# Altium schematic sheet Allwinner_A13_SCH.SchDoc
size A1; PageSetup: Record=PageOptions|CenterHorizontal=True|CenterVertical=True|PrintScale=1.00|XCorrection=1.00|YCorrection=1.00|PrintKind=0|BorderSize=5000000|LeftOffset=0|BottomOffset=0|Orientation=2|PaperLength=1000|PaperWidth=1000|Scale=100|PaperSource=4|PrintQuality=-3|MediaType=1|DitherType=10|PrintScaleMode=1|PaperKind=A4|PaperIndex=9
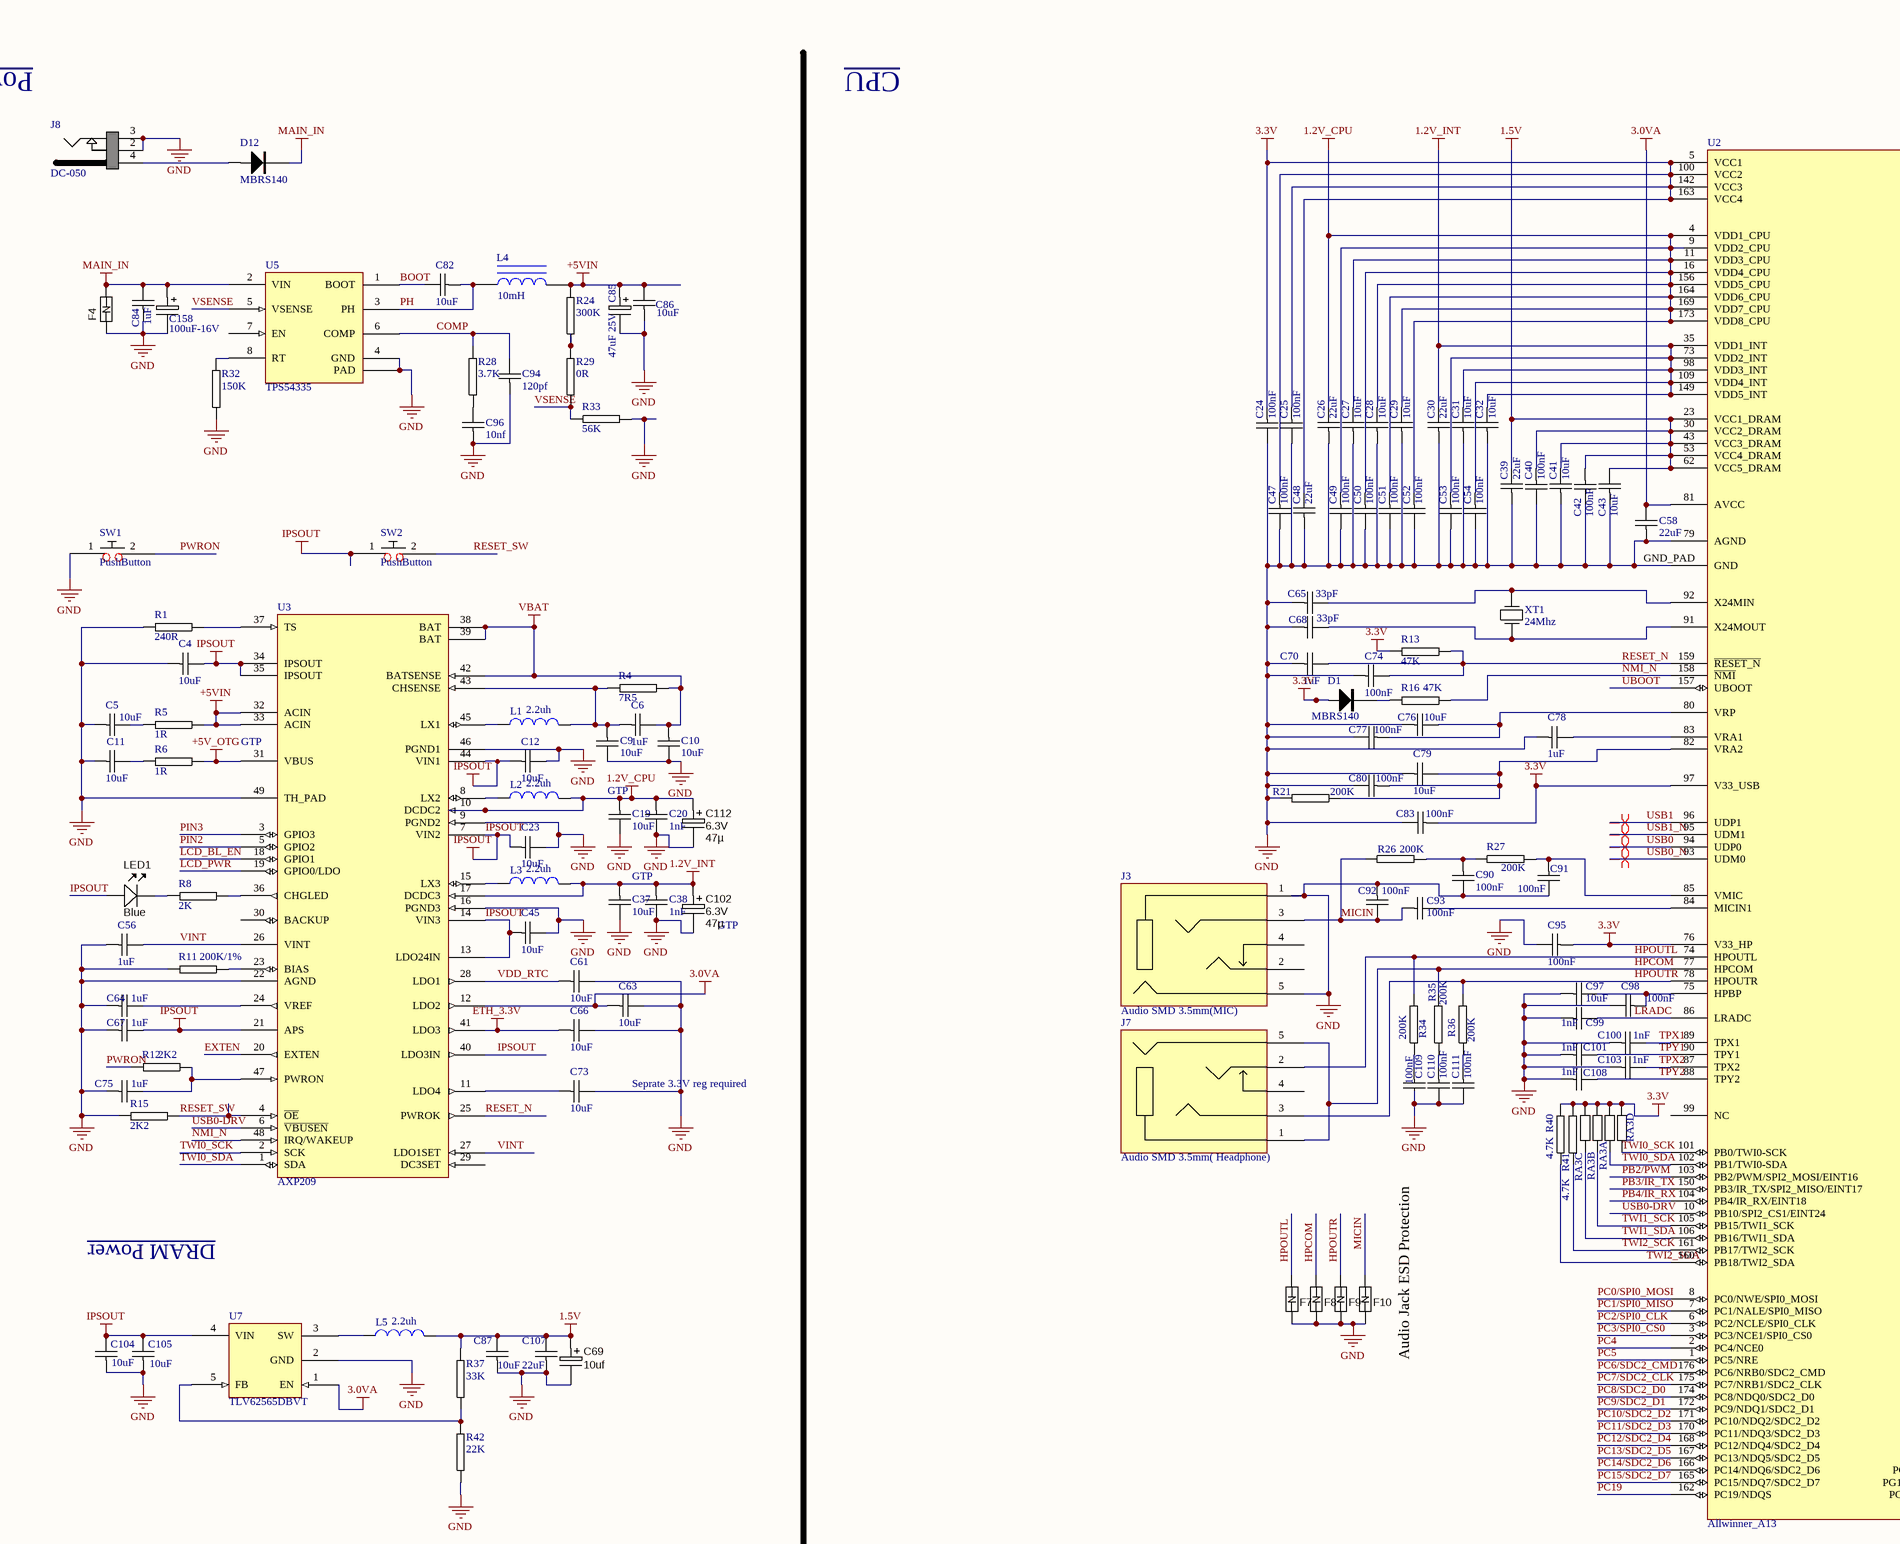
[diagram p0: Allwinner_A13_SCH.SchDoc, top left]
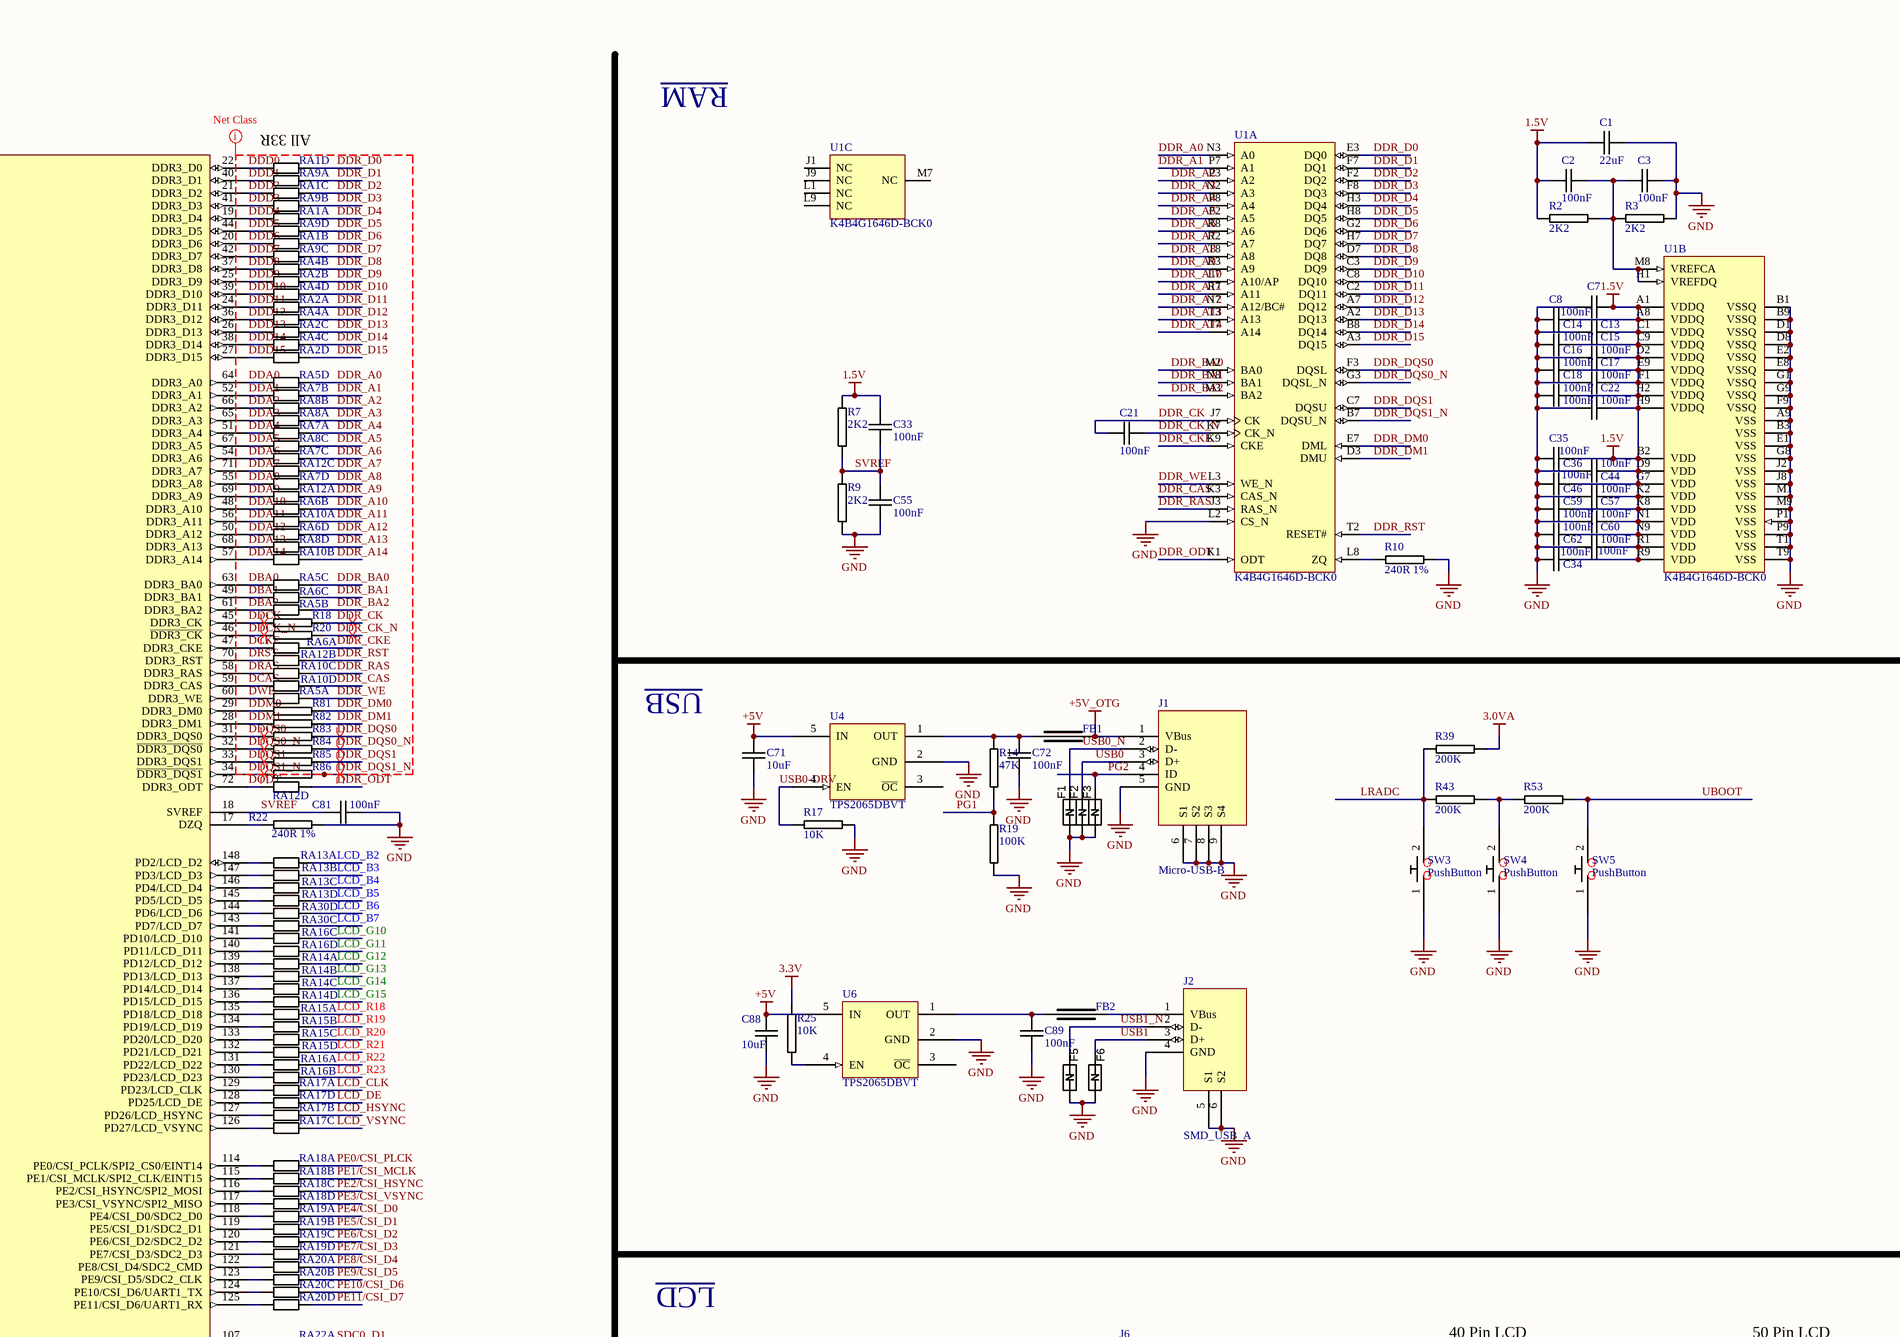
[diagram p1: Allwinner_A13_SCH.SchDoc, top right]
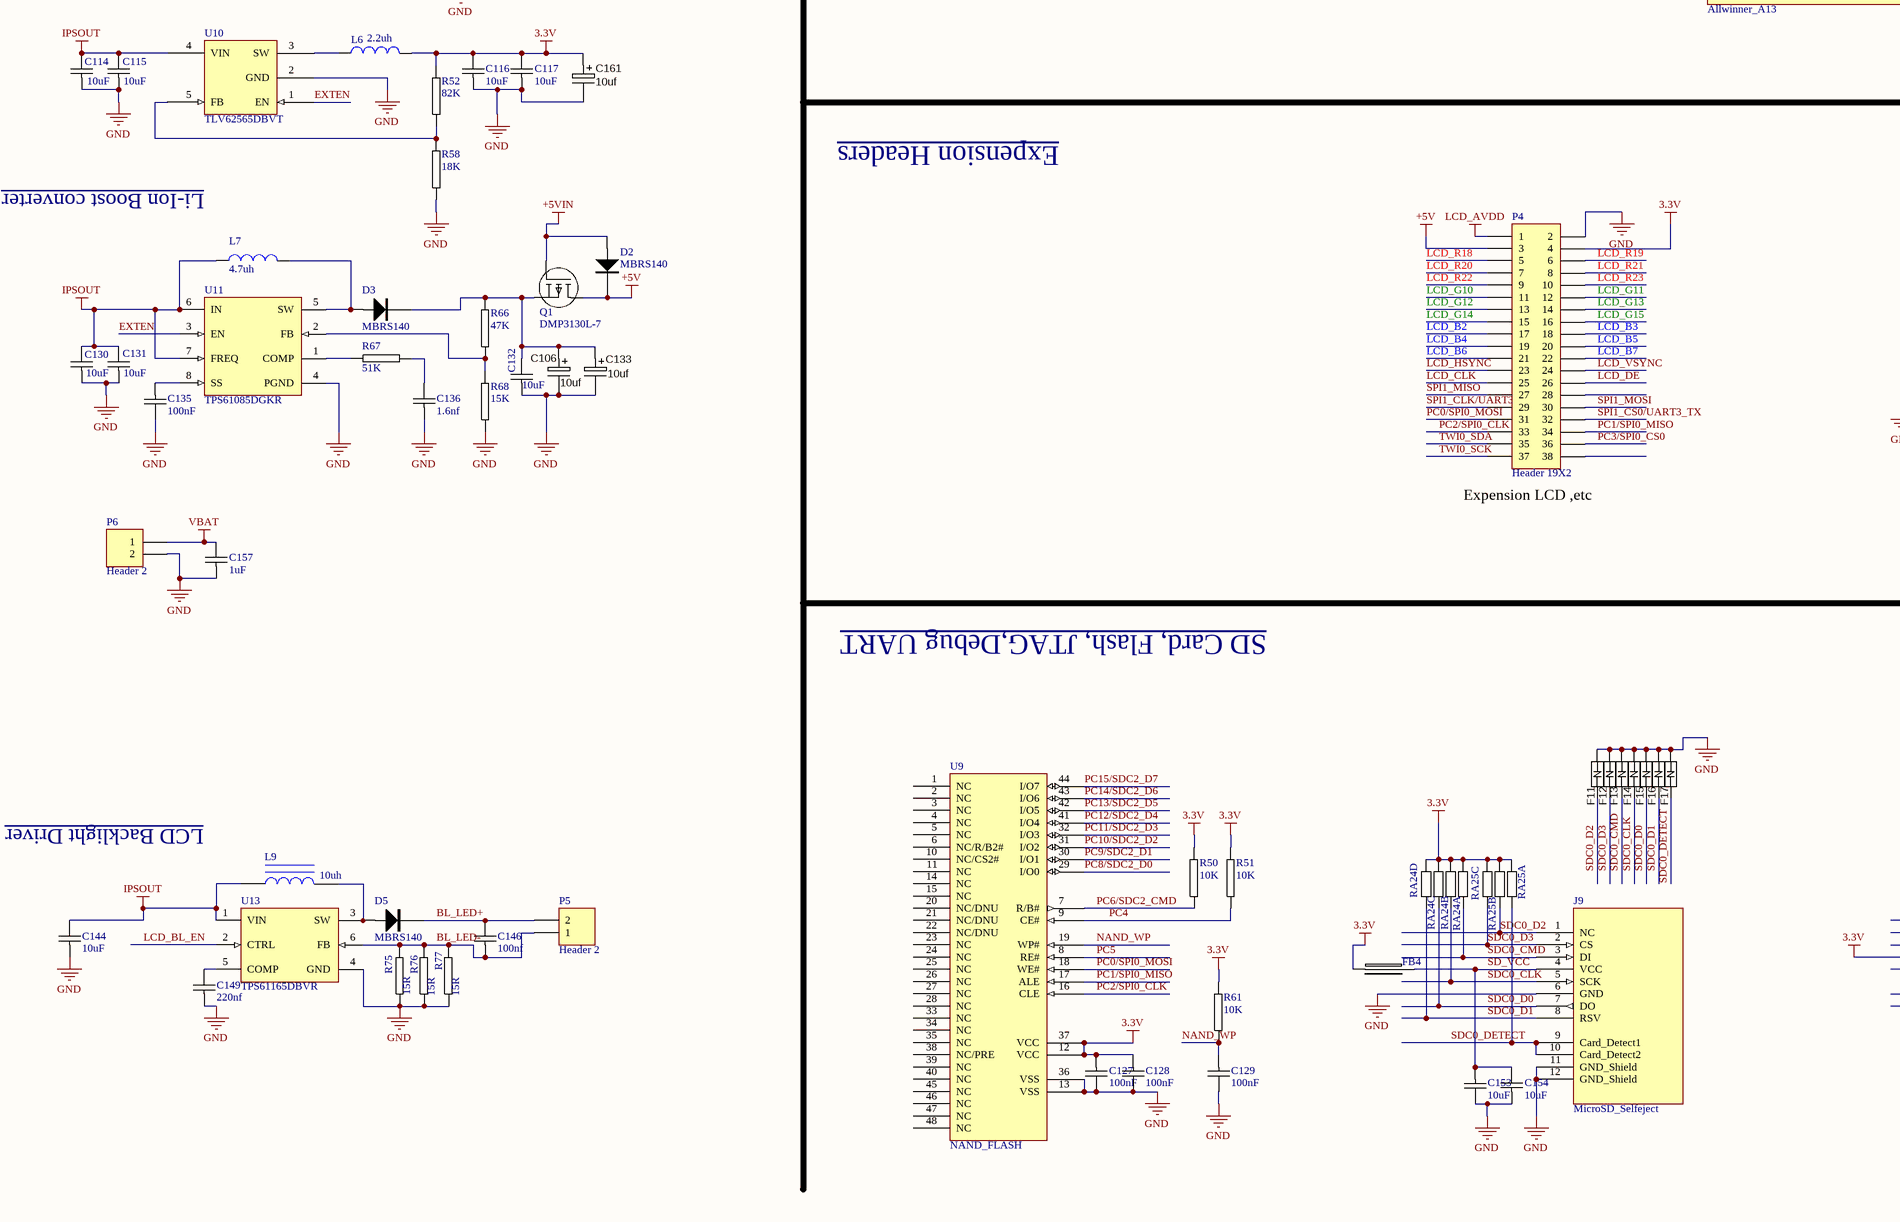
[diagram p2: Allwinner_A13_SCH.SchDoc, bottom left]
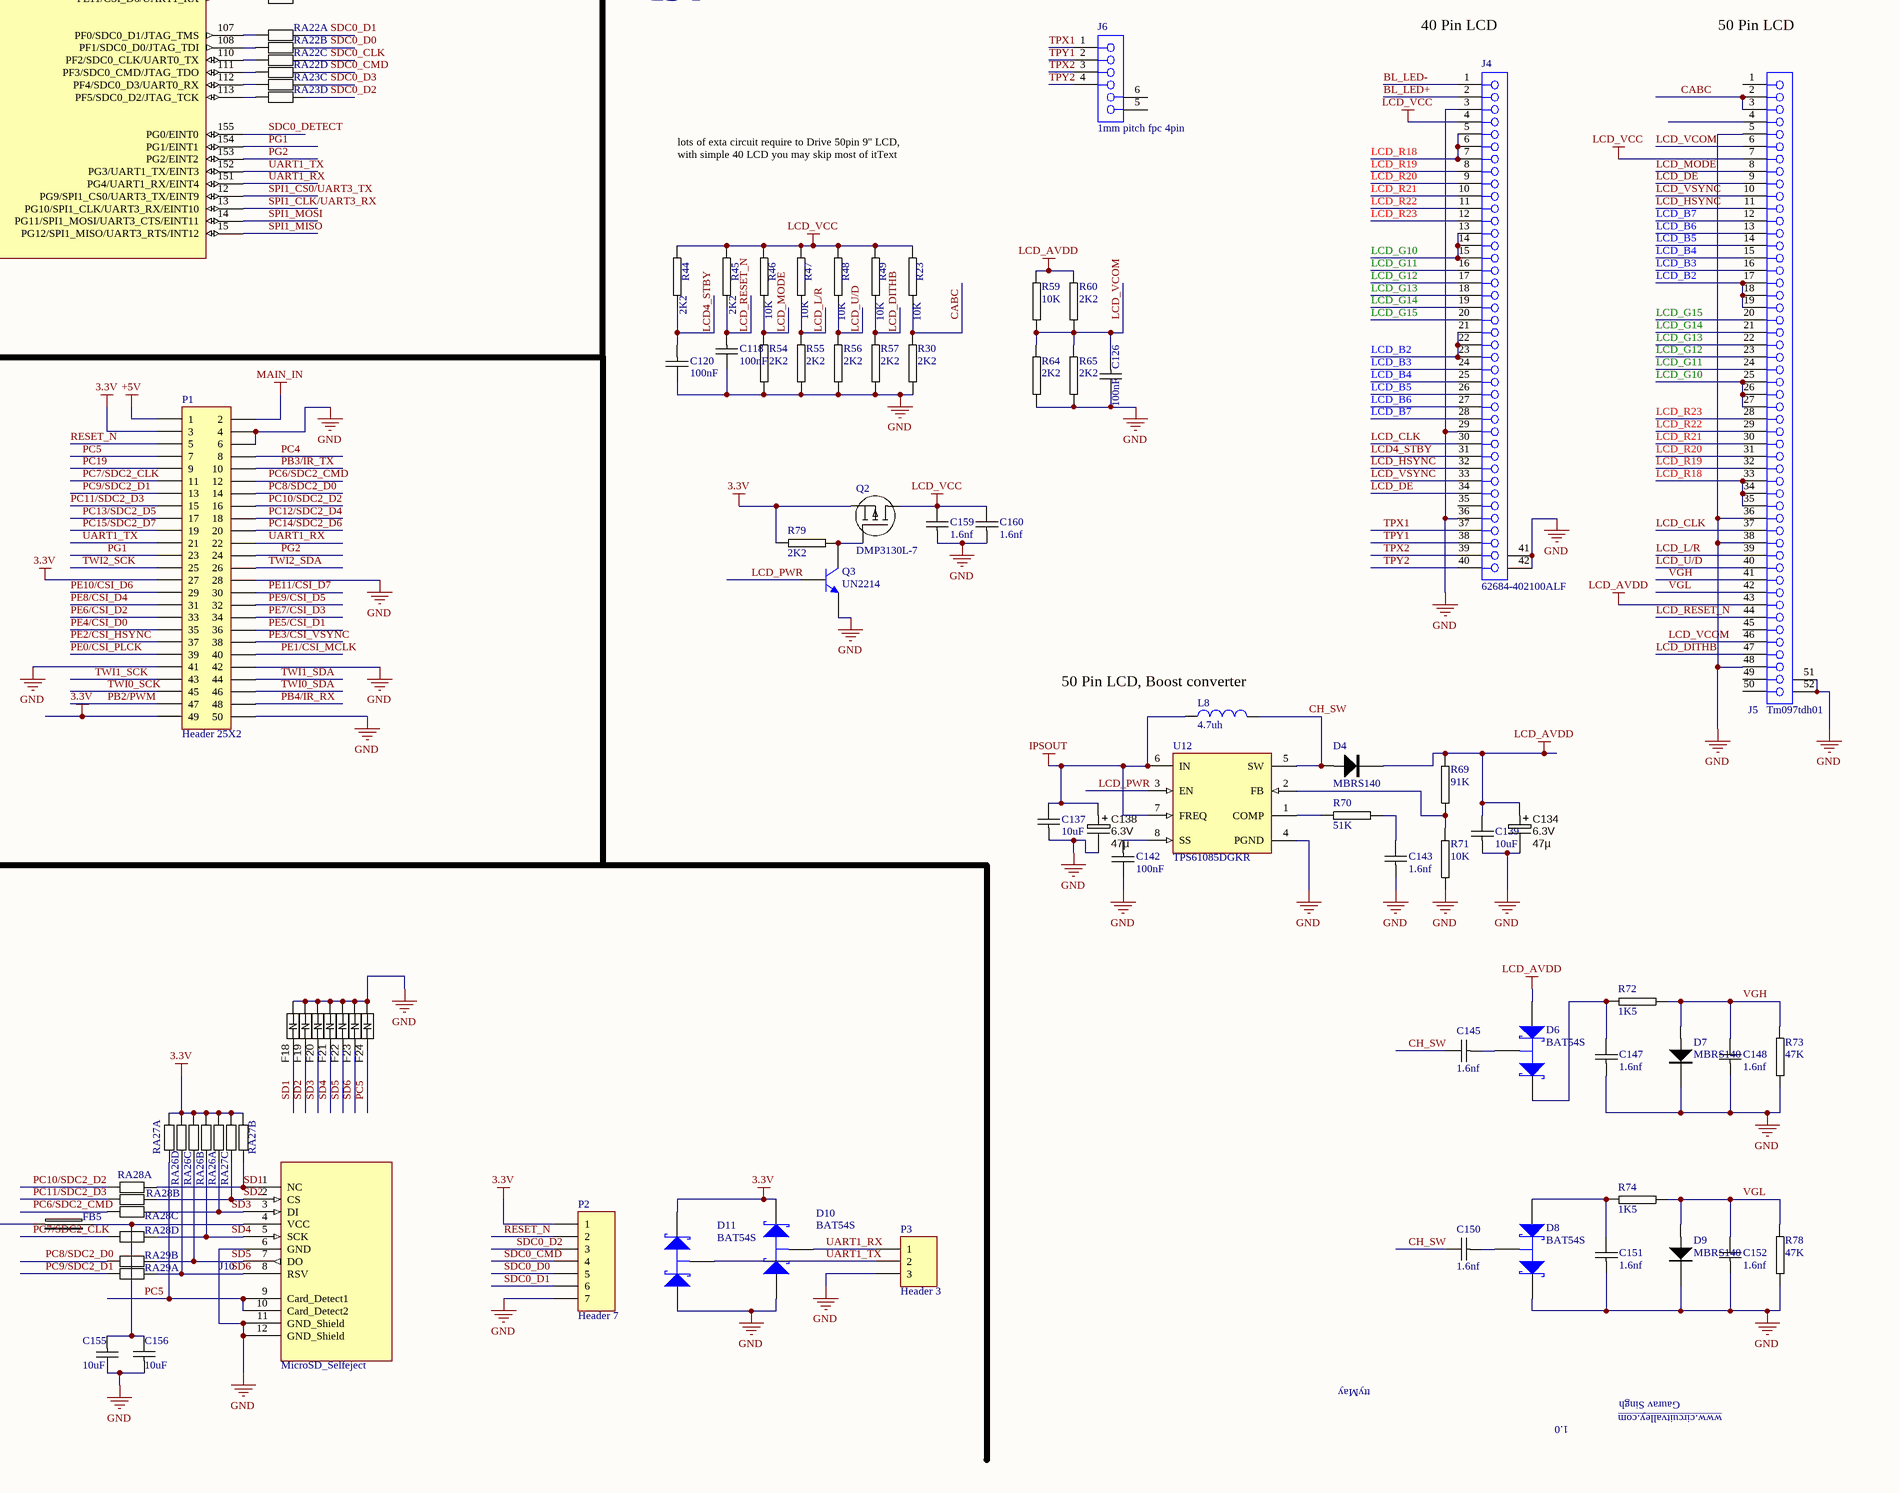
[diagram p3: Allwinner_A13_SCH.SchDoc, bottom right]

## Parts
C1  22uF  [0603C-GENERIC]
C2  100nF  [0603C-GENERIC]
C3  100nF  [0603C-GENERIC]
C4  10uF  [0603C-GENERIC]
C5  10uF  [0603C-GENERIC]
C6  1uF  [0603C-GENERIC]
C7  100nF  [0603C-GENERIC]
C8  100nF  [0603C-GENERIC]
C9  10uF  [0603C-GENERIC]
C10  10uF  [0603C-GENERIC]
C11  10uF  [0603C-GENERIC]
C12  10uF  [0603C-GENERIC]
C13  100nF  [0603C-GENERIC]
C14  100nF  [0603C-GENERIC]
C15  100nF  [0603C-GENERIC]
C16  100nF  [0603C-GENERIC]
C17  100nF  [0603C-GENERIC]
C18  100nF  [0603C-GENERIC]
C19  10uF  [0603C-GENERIC]
C20  1nF  [0603C-GENERIC]
C21  100nF  [0603C-GENERIC]
C22  100nF  [0603C-GENERIC]
C23  10uF  [0603C-GENERIC]
C24  100nF  [0603C-GENERIC]
C25  100nF  [0603C-GENERIC]
C26  22uF  [0603C-GENERIC]
C27  10uF  [0603C-GENERIC]
C28  10uF  [0603C-GENERIC]
C29  10uF  [0603C-GENERIC]
C30  22uF  [0603C-GENERIC]
C31  10uF  [0603C-GENERIC]
C32  10uF  [0603C-GENERIC]
C33  100nF  [0603C-GENERIC]
C34  100nF  [0603C-GENERIC]
C35  100nF  [0603C-GENERIC]
C36  100nF  [0603C-GENERIC]
C37  10uF  [0603C-GENERIC]
C38  1nF  [0603C-GENERIC]
C39  22uF  [0603C-GENERIC]
C40  100nF  [0603C-GENERIC]
C41  10uF  [0603C-GENERIC]
C42  100nF  [0603C-GENERIC]
C43  10uF  [0603C-GENERIC]
C44  100nF  [0603C-GENERIC]
C45  10uF  [0603C-GENERIC]
C46  100nF  [0603C-GENERIC]
C47  100nF  [0603C-GENERIC]
C48  22uF  [0603C-GENERIC]
C49  100nF  [0603C-GENERIC]
C50  100nF  [0603C-GENERIC]
C51  100nF  [0603C-GENERIC]
C52  100nF  [0603C-GENERIC]
C53  100nF  [0603C-GENERIC]
C54  100nF  [0603C-GENERIC]
C55  100nF  [0603C-GENERIC]
C56  1uF  [0603C-GENERIC]
C57  100nF  [0603C-GENERIC]
C58  22uF  [0603C-GENERIC]
C59  100nF  [0603C-GENERIC]
C60  100nF  [0603C-GENERIC]
C61  10uF  [0603C-GENERIC]
C62  100nF  [0603C-GENERIC]
C63  10uF  [0603C-GENERIC]
C64  1uF  [0603C-GENERIC]
C65  33pF  [0603C-GENERIC]
C66  10uF  [0603C-GENERIC]
C67  1uF  [0603C-GENERIC]
C68  33pF  [0603C-GENERIC]
C69  10uf  [CAPMP3528X210N]
C70  1uF  [0603C-GENERIC]
C71  10uF  [0603C-GENERIC]
C72  100nF  [0603C-GENERIC]
C73  10uF  [0603C-GENERIC]
C74  100nF  [0603C-GENERIC]
C75  1uF  [0603C-GENERIC]
C76  10uF  [0603C-GENERIC]
C77  100nF  [0603C-GENERIC]
C78  1uF  [0603C-GENERIC]
C79  10uF  [0603C-GENERIC]
C80  100nF  [0603C-GENERIC]
C81  100nF  [0603C-GENERIC]
C82  10uF  [0603C-GENERIC]
C83  100nF  [0603C-GENERIC]
C84  1uF  [0603C-GENERIC]
C85  47uF 25V  [PANACAP-E-GENERIC]
C86  10uF  [0603C-GENERIC]
C87  10uF  [0603C-GENERIC]
C88  10uF  [0603C-GENERIC]
C89  100nF  [0603C-GENERIC]
C90  100nF  [0603C-GENERIC]
C91  100nF  [0603C-GENERIC]
C92  100nF  [0603C-GENERIC]
C93  100nF  [0603C-GENERIC]
C94  120pf  [0603C-GENERIC]
C95  100nF  [0603C-GENERIC]
C96  10nf  [0603C-GENERIC]
C97  10uF  [0603C-GENERIC]
C98  100nF  [0603C-GENERIC]
C99  1nF  [0603C-GENERIC]
C100  1nF  [0603C-GENERIC]
C101  1nF  [0603C-GENERIC]
C102  Ratings: 6.3V  [CAPMP3528X210N]  (hidden comment: 47µ)
C103  1nF  [0603C-GENERIC]
C104  10uF  [0603C-GENERIC]
C105  10uF  [0603C-GENERIC]
C106  10uf  [CAPMP3528X210N]
C107  22uF  [0603C-GENERIC]
C108  1nF  [0603C-GENERIC]
C109  100nF  [0603C-GENERIC]
C110  100nF  [0603C-GENERIC]
C111  100nF  [0603C-GENERIC]
C112  Ratings: 6.3V  [CAPMP3528X210N]  (hidden comment: 47µ)
C114  10uF  [0603C-GENERIC]
C115  10uF  [0603C-GENERIC]
C116  10uF  [0603C-GENERIC]
C117  10uF  [0603C-GENERIC]
C118  100nF  [0603C-GENERIC]
C120  100nF  [0603C-GENERIC]
C126  100nF  [0603C-GENERIC]
C127  100nF  [0603C-GENERIC]
C128  100nF  [0603C-GENERIC]
C129  100nF  [0603C-GENERIC]
C130  10uF  [0603C-GENERIC]
C131  10uF  [0603C-GENERIC]
C132  10uF  [0603C-GENERIC]
C133  10uf  [CAPMP6032X280N]
C134  Ratings: 6.3V  [CAPMP3528X210N]  (hidden comment: 47µ)
C135  100nF  [0603C-GENERIC]
C136  1.6nf  [0603C-GENERIC]
C137  10uF  [0603C-GENERIC]
C138  Ratings: 6.3V  [CAPMP3528X210N]  (hidden comment: 47µ)
C139  10uF  [0603C-GENERIC]
C142  100nF  [0603C-GENERIC]
C143  1.6nf  [0603C-GENERIC]
C144  10uF  [0603C-GENERIC]
C145  1.6nf  [0603C-GENERIC]
C146  100nf  [0603C-GENERIC]
C147  1.6nf  [0603C-GENERIC]
C148  1.6nf  [0603C-GENERIC]
C149  220nf  [0603C-GENERIC]
C150  1.6nf  [0603C-GENERIC]
C151  1.6nf  [0603C-GENERIC]
C152  1.6nf  [0603C-GENERIC]
C153  10uF  [0603C-GENERIC]
C154  10uF  [0603C-GENERIC]
C155  10uF  [0603C-GENERIC]
C156  10uF  [0603C-GENERIC]
C157  1uF  [0603C-GENERIC]
C158  100uF-16V  [PANACAP-D-GENERIC]
C159  1.6nf  [0603C-GENERIC]
C160  1.6nf  [0603C-GENERIC]
C161  10uf  [CAPMP3528X210N]
D1  MBRS140  [DIODE-SMA]
D2  MBRS140  [DIODE-SMA]
D3  MBRS140  [DIODE-SMA]
D4  MBRS140  [DIODE-SMA]
D5  MBRS140  [DIODE-SMA]
D6  BAT54S  [SOT23_N]
D7  MBRS140  [DIODE-SMA]
D8  BAT54S  [SOT23_N]
D9  MBRS140  [DIODE-SMA]
D10  BAT54S  [SOT23_N]
D11  BAT54S  [SOT23_N]
D12  MBRS140  [DIODE-SMA]
F1  ESD suppressor  [0603ESDA]  (value not drawn)
F2  ESD suppressor  [0603ESDA]  (value not drawn)
F3  ESD suppressor  [0603ESDA]  (value not drawn)
F4  ESD suppressor  [0603ESDA]  (value not drawn)
F5  ESD suppressor  [0603ESDA]  (value not drawn)
F6  ESD suppressor  [0603ESDA]  (value not drawn)
F7  ESD suppressor  [0603ESDA]  (value not drawn)
F8  ESD suppressor  [0603ESDA]  (value not drawn)
F9  ESD suppressor  [0603ESDA]  (value not drawn)
F10  ESD suppressor  [0603ESDA]  (value not drawn)
F11  ESD suppressor  [0603ESDA]  (value not drawn)
F12  ESD suppressor  [0603ESDA]  (value not drawn)
F13  ESD suppressor  [0603ESDA]  (value not drawn)
F14  ESD suppressor  [0603ESDA]  (value not drawn)
F15  ESD suppressor  [0603ESDA]  (value not drawn)
F16  ESD suppressor  [0603ESDA]  (value not drawn)
F17  ESD suppressor  [0603ESDA]  (value not drawn)
F18  ESD suppressor  [0603ESDA]  (value not drawn)
F19  ESD suppressor  [0603ESDA]  (value not drawn)
F20  ESD suppressor  [0603ESDA]  (value not drawn)
F21  ESD suppressor  [0603ESDA]  (value not drawn)
F22  ESD suppressor  [0603ESDA]  (value not drawn)
F23  ESD suppressor  [0603ESDA]  (value not drawn)
F24  ESD suppressor  [0603ESDA]  (value not drawn)
FB1  (no value)  [0805FB-GENERIC]
FB2  (no value)  [0805FB-GENERIC]
FB4  (no value)  [0805FB-GENERIC]
FB5  (no value)  [0805FB-GENERIC]
J1  Micro-USB-B  [USB-MICRO-HW-MC-5F]
J2  SMD_USB_A  [USBA_HW-UAF-12]
J3  Audio SMD 3.5mm(MIC)  [SMDAudio3.5mm]
J4  62684-402100ALF  [62684-402100ALF]
J5  Tm097tdh01  [FH12A-50S-0.5SH]
J6  1mm pitch fpc 4pin  [52793-0470]
J7  Audio SMD 3.5mm( Headphone)  [SMDAudio3.5mm]
J8  DC-050  [DC-050]
J9  MicroSD_Selfeject  [MicroSD_Selfeject]
J10  MicroSD_Selfeject  [MicroSD_Selfeject]
L1  2.2uh  [TAIYO_NRS4018T2R2MDGJ]
L2  2.2uh  [TAIYO_NRS4018T2R2MDGJ]
L3  2.2uh  [TAIYO_NRS4018T2R2MDGJ]
L4  value 10mH  [Inductor-Multicomp-MCSDC060]
L5  2.2uh  [TAIYO_NRS4018T2R2MDGJ]
L6  2.2uh  [TAIYO_NRS4018T2R2MDGJ]
L7  4.7uh  [TAIYO_NR6028T4R7M]
L8  4.7uh  [TAIYO_NR6028T4R7M]
L9  value 10uh  [Inductor-Multicomp-MCSDC060]
LED1  Blue  [LED-0805-K]
P1  Header 25X2  [HDR2X25]
P2  Header 7  [HDR1X7]
P3  Header 3  [HDR1X3]
P4  Header 19X2  [HDR2X19]
P5  Header 2  [HDR1X2]
P6  Header 2  [HDR1X2]
Q1  DMP3130L-7  [SOT23-GDS]
Q2  DMP3130L-7  [SOT23-GDS]
Q3  UN2214  [SOT23_N]
R1  240R  [0603R-GENERIC]
R2  2K2  [0603R-10K]
R3  2K2  [0603R-10K]
R4  7R5  [2512R-GENERIC]
R5  1R  [0603R-GENERIC]
R6  1R  [0603R-GENERIC]
R7  2K2  [0603R-10K]
R8  2K  [0603R-220K]
R9  2K2  [0603R-10K]
R10  240R 1%  [0603R-10K]
R11  200K/1%  [0603R-220K]
R12  2K2  [0603R-2K2]
R13  47K  [0603R-47K]
R14  47K  [0603R-10K]
R15  2K2  [0603R-2K2]
R16  47K  [0603R-47K]
R17  10K  [0603R-10K]
R18  (no value)  [0402R-GENERIC]
R19  100K  [0603R-10K]
R20  (no value)  [0402R-GENERIC]
R21  200K  [0603R-220K]
R22  240R 1%  [0603R-10K]
R23  10K  [0603R-10K]
R24  300K  [0603R-2K2]
R25  10K  [0603R-10K]
R26  200K  [0603R-220K]
R27  200K  [0603R-220K]
R28  3.7K  [0603R-2K2]
R29  0R  [0603R-2K2]
R30  2K2  [0603R-2K2]
R32  150K  [0603R-2K2]
R33  56K  [0603R-2K2]
R34  200K  [0603R-220K]
R35  200K  [0603R-220K]
R36  200K  [0603R-220K]
R37  33K  [0603R-2K2]
R39  200K  [0603R-220K]
R40  4.7K  [0603R-220K]
R41  4.7K  [0603R-220K]
R42  22K  [0603R-2K2]
R43  200K  [0603R-220K]
R44  2K2  [0603R-2K2]
R45  2K2  [0603R-2K2]
R46  10K  [0603R-10K]
R47  10K  [0603R-10K]
R48  10K  [0603R-10K]
R49  10K  [0603R-10K]
R50  10K  [0603R-220K]
R51  10K  [0603R-220K]
R52  82K  [0603R-2K2]
R53  200K  [0603R-220K]
R54  2K2  [0603R-2K2]
R55  2K2  [0603R-2K2]
R56  2K2  [0603R-2K2]
R57  2K2  [0603R-2K2]
R58  18K  [0603R-2K2]
R59  10K  [0603R-10K]
R60  2K2  [0603R-2K2]
R61  10K  [0603R-220K]
R64  2K2  [0603R-2K2]
R65  2K2  [0603R-2K2]
R66  47K  [0603R-2K2]
R67  51K  [0603R-2K2]
R68  15K  [0603R-2K2]
R69  91K  [0603R-2K2]
R70  51K  [0603R-2K2]
R71  10K  [0603R-2K2]
R72  1K5  [0603R-2K2]
R73  47K  [0603R-2K2]
R74  1K5  [0603R-2K2]
R75  15R  [0603R-2K2]
R76  15R  [0603R-2K2]
R77  15R  [0603R-2K2]
R78  47K  [0603R-2K2]
R79  2K2  [0603R-2K2]
R81  (no value)  [0402R-GENERIC]
R82  (no value)  [0402R-GENERIC]
R83  (no value)  [0402R-GENERIC]
R84  (no value)  [0402R-GENERIC]
R85  (no value)  [0402R-GENERIC]
R86  (no value)  [0402R-GENERIC]
RA1  Thick Film  [EXV28V]  (value not drawn)  (parts A,B,C,D of 4)
RA2  Thick Film  [EXV28V]  (value not drawn)  (parts A,B,C,D of 4)
RA3  Thick Film  [EXV28V]  (value not drawn)  (parts A,B,C,D of 4)
RA4  Thick Film  [EXV28V]  (value not drawn)  (parts A,B,C,D of 4)
RA5  Thick Film  [EXV28V]  (value not drawn)  (parts A,B,C,D of 4)
RA6  Thick Film  [EXV28V]  (value not drawn)  (parts A,B,C,D of 4)
RA7  Thick Film  [EXV28V]  (value not drawn)  (parts A,B,C,D of 4)
RA8  Thick Film  [EXV28V]  (value not drawn)  (parts A,B,C,D of 4)
RA9  Thick Film  [EXV28V]  (value not drawn)  (parts A,B,C,D of 4)
RA10  Thick Film  [EXV28V]  (value not drawn)  (parts A,B,C,D of 4)
RA12  Thick Film  [EXV28V]  (value not drawn)  (parts A,B,C,D of 4)
RA13  Thick Film  [EXV28V]  (value not drawn)  (parts A,B,C,D of 4)
RA14  Thick Film  [EXV28V]  (value not drawn)  (parts A,B,C,D of 4)
RA15  Thick Film  [EXV28V]  (value not drawn)  (parts A,B,C,D of 4)
RA16  Thick Film  [EXV28V]  (value not drawn)  (parts A,B,C,D of 4)
RA17  Thick Film  [EXV28V]  (value not drawn)  (parts A,B,C,D of 4)
RA18  Thick Film  [EXV28V]  (value not drawn)  (parts A,B,C,D of 4)
RA19  Thick Film  [EXV28V]  (value not drawn)  (parts A,B,C,D of 4)
RA20  Thick Film  [EXV28V]  (value not drawn)  (parts A,B,C,D of 4)
RA22  Thick Film  [EXV28V]  (value not drawn)  (parts A,B,C,D of 4)
RA23  Thick Film  [EXV28V]  (value not drawn)  (parts C,D of 4)
RA24  Thick Film  [EXV28V]  (value not drawn)  (parts A,B,C,D of 4)
RA25  Thick Film  [EXV28V]  (value not drawn)  (parts A,B,C of 4)
RA26  Thick Film  [EXV28V]  (value not drawn)  (parts A,B,C,D of 4)
RA27  Thick Film  [EXV28V]  (value not drawn)  (parts A,B,C of 4)
RA28  Thick Film  [EXV28V]  (value not drawn)  (parts A,B,C,D of 4)
RA29  Thick Film  [EXV28V]  (value not drawn)  (parts A,B of 4)
RA30  Thick Film  [EXV28V]  (value not drawn)  (parts C,D of 4)
SW1  PushButton  [PushButtonGrid5.08x3.81]
SW2  PushButton  [PushButtonGrid5.08x3.81]
SW3  PushButton  [PushButtonGrid5.08x3.81]
SW4  PushButton  [PushButtonGrid5.08x3.81]
SW5  PushButton  [PushButtonGrid5.08x3.81]
U1  K4B4G1646D-BCK0  [MICT-JT-96]  (parts A,B,C of 3)
U2  Allwinner_A13  [LQFP176L]
U3  AXP209  [QFN48]
U4  TPS2065DBVT  [TSOT23-5]
U5  TPS54335  [D008_L_PowerPad]
U6  TPS2065DBVT  [TSOT23-5]
U7  TLV62565DBVT  [TSOT23-5]
U9  NAND_FLASH  [TSOP-48]
U10  TLV62565DBVT  [TSOT23-5]
U11  TPS61085DGKR  [TI-DGK8_N]
U12  TPS61085DGKR  [TI-DGK8_N]
U13  TPS61165DBVR  [TI-DBV6_N]
XT1  24Mhz  [Ceramic_crystal_5x3.2]

## Nets
1.2V_CPU: C19.1 C20.1 C26.2 C27.2 C28.2 C29.2 C49.1 C50.1 C51.1 C52.1 C112.1 L2.2 U2.4(VDD1_CPU) U2.9(VDD2_CPU) U2.11(VDD3_CPU) U2.16(VDD4_CPU) U2.156(VDD5_CPU) U2.164(VDD6_CPU) U2.169(VDD7_CPU) U2.173(VDD8_CPU) U3.10(DCDC2)
1.2V_INT: C30.2 C31.2 C32.2 C37.1 C38.1 C53.1 C54.1 C102.1 L3.2 U2.35(VDD1_INT) U2.73(VDD2_INT) U2.98(VDD3_INT) U2.109(VDD4_INT) U2.149(VDD5_INT) U3.17(DCDC3)
1.5V: C1.2 C2.2 C7.1 C8.1 C13.1 C14.1 C15.1 C16.1 C17.1 C18.1 C22.1 C33.2 C34.1 C35.1 C36.1 C39.2 C40.1 C41.2 C42.1 C43.2 C44.1 C46.1 C57.1 C59.1 C60.1 C62.1 C69.1 C87.2 C107.2 L5.2 R2.2 R7.2 R37.2 U1.A1(VDDQ) U1.A8(VDDQ) U1.B2(VDD) U1.C1(VDDQ) U1.C9(VDDQ) U1.D2(VDDQ) U1.D9(VDD) U1.E9(VDDQ) U1.F1(VDDQ) U1.G7(VDD) U1.H2(VDDQ) U1.H9(VDDQ) U1.K2(VDD) U1.K8(VDD) U1.N1(VDD) U1.N9(VDD) U1.R1(VDD) U1.R9(VDD) U2.23(VCC1_DRAM) U2.30(VCC2_DRAM) U2.43(VCC3_DRAM) U2.53(VCC4_DRAM) U2.62(VCC5_DRAM)
3.0VA: C58.2 C63.1 R39.1 U2.81(AVCC) U3.12(LDO2) U7.1(EN)
3.3V: C24.1 C25.1 C47.1 C48.2 C83.1 C95.1 C116.2 C117.2 C127.1 C128.1 C161.1 D1.A D10.2(K) D11.2(K) FB4.1 FB5.1 L6.2 P1.3 P1.27 P1.49 P2.1 P4.4 Q2.S R13.1 R25.1 R40.2 R41.2 R50.2 R51.2 R52.2 R61.2 R79.2 RA3.1 RA3.2 RA3.3 RA3.4 RA24.1 RA24.2 RA24.3 RA24.4 RA25.1 RA25.2 RA25.3 RA26.1 RA26.2 RA26.3 RA26.4 RA27.1 RA27.2 RA27.3 U2.5(VCC1) U2.76(V33_HP) U2.97(V33_USB) U2.100(VCC2) U2.142(VCC3) U2.163(VCC4) U9.12(VCC) U9.37(VCC)
+5V: C71.2 C88.2 D2.K P1.1 P4.3 Q1.D U4.5(IN) U6.5(IN)
+5V_OTG: FB1.2 J1.1(VBus) R6.2 U3.31(VBUS)
+5VIN: C85.+ C86.2 D2.A L4.2 Q1.G R5.2 R24.2 U3.32(ACIN) U3.33(ACIN)
ETH_3.3V: C66.1 U3.41(LDO3)
GND: C1.1 C3.1 C4.1 C5.1 C7.2 C8.2 C9.2 C10.2 C11.1 C12.2 C13.2 C14.2 C15.2 C16.2 C17.2 C18.2 C19.2 C20.2 C22.2 C23.2 C24.2 C25.2 C26.1 C27.1 C28.1 C29.1 C30.1 C31.1 C32.1 C34.2 C35.2 C36.2 C37.2 C38.2 C39.1 C40.2 C41.1 C42.2 C43.1 C44.2 C45.2 C46.2 C47.2 C48.1 C49.2 C50.2 C51.2 C52.2 C53.2 C54.2 C55.1 C56.1 C57.2 C58.1 C59.2 C60.2 C61.2 C62.2 C63.2 C64.1 C65.1 C66.2 C67.1 C68.1 C69.2 C70.1 C71.1 C72.1 C73.2 C74.1 C75.1 C76.1 C77.2 C78.1 C79.1 C80.2 C81.1 C83.2 C84.1 C85.- C86.1 C87.1 C88.1 C89.1 C90.2 C91.2 C92.1 C94.1 C95.2 C96.1 C97.1 C98.2 C99.1 C100.1 C101.1 C102.2 C103.1 C104.1 C105.1 C106.2 C107.1 C108.1 C109.2 C110.2 C111.2 C112.2 C114.1 C115.1 C116.1 C117.1 C118.2 C120.2 C126.2 C127.2 C128.2 C129.2 C130.1 C131.1 C132.1 C133.2 C134.2 C135.2 C136.1 C137.1 C138.2 C139.1 C142.2 C143.1 C144.1 C147.1 C148.1 C149.1 C151.1 C152.1 C153.2 C154.1 C155.2 C156.1 C157.1 C158.- C159.1 C160.1 C161.2 D7.K D8.2(K) D9.K D10.1(A) D11.1(A) F1.1 F2.1 F3.1 F4.1 F5.1 F6.1 F7.1 F8.1 F9.1 F10.1 F11.2 F12.2 F13.2 F14.2 F15.2 F16.2 F17.2 F18.2 F19.2 F20.2 F21.2 F22.2 F23.2 F24.2 J1.5(GND) J1.6(S1) J1.7(S2) J1.8(S3) J1.9(S4) J2.4(GND) J2.5(S1) J2.6(S2) J3.1 J3.5 J4.3 J4.29 J4.36 J4.41(MH1) J4.42(MH2) J5.5 J5.36 J5.38 J5.48 J5.51(MH1) J5.52(MH2) J8.2 J8.3 J9.6(GND) J9.11(GND_Shield) J9.12(GND_Shield) J10.6(GND) J10.11(GND_Shield) J10.12(GND_Shield) P1.4 P1.6 P1.28 P1.41 P1.42 P1.50 P2.7 P3.3 P4.2 P6.2 Q3.2(E) R1.1 R3.2 R9.2 R10.1 R11.1 R15.1 R17.1 R19.2 R21.1 R22.1 R30.2 R32.1 R33.1 R42.1 R54.2 R55.2 R56.2 R57.2 R58.1 R64.2 R65.2 R68.1 R71.1 R73.2 R75.1 R76.1 R77.1 R78.2 SW1.1(P1) SW3.1(P1) SW4.1(P1) SW5.1(P1) U1.A9(VSS) U1.B1(VSSQ) U1.B3(VSS) U1.B9(VSSQ) U1.D1(VSSQ) U1.D8(VSSQ) U1.E1(VSS) U1.E2(VSSQ) U1.E8(VSSQ) U1.F9(VSSQ) U1.G1(VSSQ) U1.G8(VSS) U1.G9(VSSQ) U1.J2(VSS) U1.J8(VSS) U1.L2(CS_N) U1.M1(VSS) U1.M9(VSS) U1.P1(VSS) U1.P9(VSS) U1.T1(VSS) U1.T9(VSS) U2.79(AGND) U2.GND_PAD(GND) U3.9(PGND2) U3.16(PGND3) U3.22(AGND) U3.46(PGND1) U3.49(TH_PAD) U4.2(GND) U5.4(GND) U5.9(PAD) U6.2(GND) U7.2(GND) U9.13(VSS) U9.36(VSS) U10.2(GND) U11.4(PGND) U12.4(PGND) U13.4(GND)
IPSOUT: C4.2 C12.1 C23.1 C45.1 C67.2 C104.2 C105.2 C114.2 C115.2 C130.2 C131.2 C137.2 C138.1 C144.2 L7.1 L8.1 L9.1 LED1.A SW2.1(P1) U3.7(VIN2) U3.13(LDO24IN) U3.14(VIN3) U3.21(APS) U3.34(IPSOUT) U3.35(IPSOUT) U3.40(LDO3IN) U3.44(VIN1) U7.4(VIN) U10.4(VIN) U11.6(IN) U11.7(FREQ) U12.6(IN) U12.7(FREQ) U13.1(VIN)
LCD_AVDD: C134.1 C139.2 D4.K D6.1(A) J5.43 P4.1 R59.1 R60.1 R69.2
LCD_VCC: C159.2 C160.2 J4.4 J5.7 Q2.D R23.1 R44.1 R45.1 R46.1 R47.1 R48.1 R49.1
MAIN_IN: C84.2 C158.+ D12.K F4.2 P1.2 U5.2(VIN)
VBAT: C6.2 C10.1 C157.2 P6.1 R4.2 U3.38(BAT) U3.39(BAT) U3.42(BATSENSE)
BL_LED+: C146.2 D5.K J4.2 P5.2
BL_LED-: C146.1 J4.1 P5.1 R75.2 R76.2 R77.2 U13.6(FB)
BOOT: C82.2 U5.1(BOOT)
CABC: J5.2 J5.3 R23.2 R30.1
CH_SW: C145.2 C150.2 D4.A L8.2 U12.5(SW)
COMP: C94.2 R28.2 U5.6(COMP)
DBA0: RA5.6 U2.63(DDR3_BA0)
DBA1: RA6.6 U2.49(DDR3_BA1)
DBA2: RA5.7 U2.61(DDR3_BA2)
DCAS: RA10.5 U2.59(DDR3_CAS)
DCKE: RA6.8 U2.47(DDR3_CKE)
DDA0: RA5.5 U2.64(DDR3_A0)
DDA1: RA7.7 U2.52(DDR3_A1)
DDA2: RA8.7 U2.66(DDR3_A2)
DDA3: RA8.8 U2.65(DDR3_A3)
DDA4: RA7.8 U2.51(DDR3_A4)
DDA5: RA8.6 U2.67(DDR3_A5)
DDA6: RA7.6 U2.54(DDR3_A6)
DDA7: RA12.6 U2.71(DDR3_A7)
DDA8: RA7.5 U2.55(DDR3_A8)
DDA9: RA12.8 U2.69(DDR3_A9)
DDA10: RA6.7 U2.48(DDR3_A10)
DDA11: RA10.8 U2.56(DDR3_A11)
DDA12: RA6.5 U2.50(DDR3_A12)
DDA13: RA8.5 U2.68(DDR3_A13)
DDA14: RA10.7 U2.57(DDR3_A14)
DDCK: R18.1 U2.45(DDR3_CK)
DDCK_N: R20.1 U2.46(~{DDR3_CK})
DDD0: RA1.5 U2.22(DDR3_D0)
DDD1: RA9.8 U2.40(DDR3_D1)
DDD2: RA1.6 U2.21(DDR3_D2)
DDD3: RA9.7 U2.41(DDR3_D3)
DDD4: RA1.8 U2.19(DDR3_D4)
DDD5: RA9.5 U2.44(DDR3_D5)
DDD6: RA1.7 U2.20(DDR3_D6)
DDD7: RA9.6 U2.42(DDR3_D7)
DDD8: RA4.7 U2.37(DDR3_D8)
DDD9: RA2.7 U2.25(DDR3_D9)
DDD10: RA4.5 U2.39(DDR3_D10)
DDD11: RA2.8 U2.24(DDR3_D11)
DDD12: RA4.8 U2.36(DDR3_D12)
DDD13: RA2.6 U2.26(DDR3_D13)
DDD14: RA4.6 U2.38(DDR3_D14)
DDD15: RA2.5 U2.27(DDR3_D15)
DDM0: R81.1 U2.29(DDR3_DM0)
DDM1: R82.1 U2.28(DDR3_DM1)
DDQS0: R83.1 U2.31(DDR3_DQS0)
DDQS0_N: R84.1 U2.32(~{DDR3_DQS0})
DDQS1: R85.1 U2.33(DDR3_DQS1)
DDQS1_N: R86.1 U2.34(~{DDR3_DQS1})
DDR_A0: RA5.4 U1.N3(A0)
DDR_A1: RA7.2 U1.P7(A1)
DDR_A2: RA8.2 U1.P3(A2)
DDR_A3: RA8.1 U1.N2(A3)
DDR_A4: RA7.1 U1.P8(A4)
DDR_A5: RA8.3 U1.P2(A5)
DDR_A6: RA7.3 U1.R8(A6)
DDR_A7: RA12.3 U1.R2(A7)
DDR_A8: RA7.4 U1.T8(A8)
DDR_A9: RA12.1 U1.R3(A9)
DDR_A10: RA6.2 U1.L7(A10/AP)
DDR_A11: RA10.1 U1.R7(A11)
DDR_A12: RA6.4 U1.N7(A12/BC#)
DDR_A13: RA8.4 U1.T3(A13)
DDR_A14: RA10.2 U1.T7(A14)
DDR_BA0: RA5.3 U1.M2(BA0)
DDR_BA1: RA6.3 U1.N8(BA1)
DDR_BA2: RA5.2 U1.M3(BA2)
DDR_CAS: RA10.4 U1.K3(CAS_N)
DDR_CK: C21.2 R18.2 U1.J7(CK)
DDR_CK_N: C21.1 R20.2 U1.K7(CK_N)
DDR_CKE: RA6.1 U1.K9(CKE)
DDR_D0: RA1.4 U1.E3(DQ0)
DDR_D1: RA9.1 U1.F7(DQ1)
DDR_D2: RA1.3 U1.F2(DQ2)
DDR_D3: RA9.2 U1.F8(DQ3)
DDR_D4: RA1.1 U1.H3(DQ4)
DDR_D5: RA9.4 U1.H8(DQ5)
DDR_D6: RA1.2 U1.G2(DQ6)
DDR_D7: RA9.3 U1.H7(DQ7)
DDR_D8: RA4.2 U1.D7(DQ8)
DDR_D9: RA2.2 U1.C3(DQ9)
DDR_D10: RA4.4 U1.C8(DQ10)
DDR_D11: RA2.1 U1.C2(DQ11)
DDR_D12: RA4.1 U1.A7(DQ12)
DDR_D13: RA2.3 U1.A2(DQ13)
DDR_D14: RA4.3 U1.B8(DQ14)
DDR_D15: RA2.4 U1.A3(DQ15)
DDR_DM0: R81.2 U1.E7(DML)
DDR_DM1: R82.2 U1.D3(DMU)
DDR_DQS0: R83.2 U1.F3(DQSL)
DDR_DQS0_N: R84.2 U1.G3(DQSL_N)
DDR_DQS1: R85.2 U1.C7(DQSU)
DDR_DQS1_N: R86.2 U1.B7(DQSU_N)
DDR_ODT: RA12.4 U1.K1(ODT)
DDR_RAS: RA10.3 U1.J3(RAS_N)
DDR_RST: RA12.2 U1.T2(RESET#)
DDR_WE: RA5.1 U1.L3(WE_N)
DODT: RA12.5 U2.72(DDR3_ODT)
DRAS: RA10.6 U2.58(DDR3_RAS)
DRST: RA12.7 U2.70(DDR3_RST)
DWE: RA5.8 U2.60(DDR3_WE)
EXTEN: U3.20(EXTEN) U10.1(EN) U11.3(EN)
HPCOM: F8.2 J7.1 J7.5 R35.2 U2.77(HPCOM)
HPOUTL: F7.2 J7.2 R34.2 U2.74(HPOUTL)
HPOUTR: F9.2 J7.3 R36.2 U2.78(HPOUTR)
LCD4_STBY: C120.1 J4.31 R44.2
LCD_B2: J4.21 J4.22 J4.23 J5.17 J5.18 J5.19 P4.17 RA13.1
LCD_B3: J4.24 J5.16 P4.18 RA13.2
LCD_B4: J4.25 J5.15 P4.19 RA13.3
LCD_B5: J4.26 J5.14 P4.20 RA13.4
LCD_B6: J4.27 J5.13 P4.21 RA30.5
LCD_B7: J4.28 J5.12 P4.22 RA30.6
LCD_BL_EN: U3.18(GPIO1) U13.2(CTRL)
LCD_CLK: J4.30 J5.37 P4.25 RA17.1
LCD_DE: J4.34 J5.9 P4.26 RA17.4
LCD_DITHB: J5.47 R49.2 R57.1
LCD_G10: J4.13 J4.14 J4.15 J5.25 J5.26 J5.27 P4.11 RA16.3
LCD_G11: J4.16 J5.24 P4.12 RA16.4
LCD_G12: J4.17 J5.23 P4.13 RA14.1
LCD_G13: J4.18 J5.22 P4.14 RA14.2
LCD_G14: J4.19 J5.21 P4.15 RA14.3
LCD_G15: J4.20 J5.20 P4.16 RA14.4
LCD_HSYNC: J4.32 J5.11 P4.23 RA17.2
LCD_L/R: J5.39 R47.2 R55.1
LCD_MODE: J5.8 R46.2 R54.1
LCD_PWR: Q3.1(B) U3.19(GPIO0/LDO) U12.3(EN)
LCD_R18: J4.5 J4.6 J4.7 J5.33 J5.34 J5.35 P4.5 RA15.1
LCD_R19: J4.8 J5.32 P4.6 RA15.2
LCD_R20: J4.9 J5.31 P4.7 RA15.3
LCD_R21: J4.10 J5.30 P4.8 RA15.4
LCD_R22: J4.11 J5.29 P4.9 RA16.1
LCD_R23: J4.12 J5.28 P4.10 RA16.2
LCD_RESET_N: C118.1 J5.44 R45.2
LCD_U/D: J5.40 R48.2 R56.1
LCD_VCOM: C126.1 J5.6 J5.46 R59.2 R60.2 R64.1 R65.1
LCD_VSYNC: J4.33 J5.10 P4.24 RA17.3
LRADC: C99.2 R39.2 R43.2 SW3.2(P2) U2.86(LRADC)
MICIN: C92.2 C93.1 F10.2 J3.3 R26.2
NAND_WP: C129.1 R61.1 U9.19(WP#)
NMI_N: R16.2 U2.158(~{NMI}) U3.48(IRQ/WAKEUP)
PB2/PWM: P1.47 U2.103(PB2/PWM/SPI2_MOSI/EINT16)
PB3/IR_TX: P1.10 U2.150(PB3/IR_TX/SPI2_MISO/EINT17)
PB4/IR_RX: P1.48 U2.104(PB4/IR_RX/EINT18)
PC0/SPI0_MOSI: P4.31 U2.8(PC0/NWE/SPI0_MOSI) U9.18(WE#)
PC1/SPI0_MISO: P4.34 U2.7(PC1/NALE/SPI0_MISO) U9.17(ALE)
PC2/SPI0_CLK: P4.33 U2.6(PC2/NCLE/SPI0_CLK) U9.16(CLE)
PC3/SPI0_CS0: P4.36 U2.3(PC3/NCE1/SPI0_CS0)
PC4: P1.8 R51.1 U2.2(PC4/NCE0) U9.9(CE#)
PC5: F24.1 J10.9(Card_Detect1) J10.10(Card_Detect2) P1.7 RA27.8 U2.1(PC5/NRE) U9.8(RE#)
PC6/SDC2_CMD: P1.12 R50.1 RA28.6 U2.176(PC6/NRB0/SDC2_CMD) U9.7(R/B#)
PC7/SDC2_CLK: P1.11 RA28.5 U2.175(PC7/NRB1/SDC2_CLK)
PC8/SDC2_D0: P1.14 RA29.7 U2.174(PC8/NDQ0/SDC2_D0) U9.29(I/O0)
PC9/SDC2_D1: P1.13 RA29.8 U2.172(PC9/NDQ1/SDC2_D1) U9.30(I/O1)
PC10/SDC2_D2: P1.16 RA28.8 U2.171(PC10/NDQ2/SDC2_D2) U9.31(I/O2)
PC11/SDC2_D3: P1.15 RA28.7 U2.170(PC11/NDQ3/SDC2_D3) U9.32(I/O3)
PC12/SDC2_D4: P1.18 U2.168(PC12/NDQ4/SDC2_D4) U9.41(I/O4)
PC13/SDC2_D5: P1.17 U2.167(PC13/NDQ5/SDC2_D5) U9.42(I/O5)
PC14/SDC2_D6: P1.20 U2.166(PC14/NDQ6/SDC2_D6) U9.43(I/O6)
PC15/SDC2_D7: P1.19 U2.165(PC15/NDQ7/SDC2_D7) U9.44(I/O7)
PC19: P1.9 U2.162(PC19/NDQS)
PE0/CSI_PLCK: P1.39 RA18.1
PE1/CSI_MCLK: P1.40 RA18.2
PE2/CSI_HSYNC: P1.37 RA18.3
PE3/CSI_VSYNC: P1.38 RA18.4
PE4/CSI_D0: P1.35 RA19.1
PE5/CSI_D1: P1.36 RA19.2
PE6/CSI_D2: P1.33 RA19.3
PE7/CSI_D3: P1.34 RA19.4
PE8/CSI_D4: P1.31 RA20.1
PE9/CSI_D5: P1.32 RA20.2
PE10/CSI_D6: P1.29 RA20.3
PE11/CSI_D7: P1.30 RA20.4
PG1: P1.23 R14.2 R19.1 U2.154(PG1/EINT1)
PG2: F3.2 J1.4(ID) P1.24 U2.153(PG2/EINT2)
PH: C82.1 L4.1 U5.3(PH)
PIN2: U3.5(GPIO2)
PIN3: U3.3(GPIO3)
PWRON: R12.1 SW1.2(P2)
RESET_N: C70.2 C74.2 P1.5 P2.2 R13.2 U2.159(~{RESET_N}) U3.25(PWROK)
RESET_SW: R15.2 SW2.2(P2) U3.4(~{OE})
SD1: F18.1 J10.1(NC) RA27.7 RA28.1
SD2: F19.1 J10.2(CS) RA27.6 RA28.2
SD3: F20.1 J10.3(DI) RA26.8 RA28.3
SD4: F21.1 J10.5(SCK) RA26.7 RA28.4
SD5: F22.1 J10.7(DO) RA26.6 RA29.2
SD6: F23.1 J10.8(RSV) RA26.5 RA29.1
SD_VCC: C153.1 C154.2 FB4.2 J9.4(VCC)
SDC0_CLK: F14.1 J9.5(SCK) RA22.3 RA24.7
SDC0_CMD: F13.1 J9.3(DI) P2.4 RA22.4 RA24.8
SDC0_D0: F15.1 J9.7(DO) P2.5 RA22.2 RA24.6
SDC0_D1: F16.1 J9.8(RSV) P2.6 RA22.1 RA24.5
SDC0_D2: F11.1 J9.1(NC) P2.3 RA23.4 RA25.7
SDC0_D3: F12.1 J9.2(CS) RA23.3 RA25.6
SDC0_DETECT: F17.1 J9.9(Card_Detect1) J9.10(Card_Detect2) RA25.8 U2.155(PG0/EINT0)
SPI1_CLK/UART3_RX: P4.29 U2.13(PG10/SPI1_CLK/UART3_RX/EINT10)
SPI1_CS0/UART3_TX: P4.32 U2.12(PG9/SPI1_CS0/UART3_TX/EINT9)
SPI1_MISO: P4.27 U2.15(PG12/SPI1_MISO/UART3_RTS/INT12)
SPI1_MOSI: P4.30 U2.14(PG11/SPI1_MOSI/UART3_CTS/EINT11)
SVREF: C33.1 C55.2 C81.2 R7.1 R9.1 U2.18(SVREF)
TPX1: C100.2 J4.37 J6.1 U2.89(TPX1)
TPX2: C103.2 J4.39 J6.3 U2.87(TPX2)
TPY1: C101.2 J4.38 J6.2 U2.90(TPY1)
TPY2: C108.2 J4.40 J6.4 U2.88(TPY2)
TWI0_SCK: P1.45 P4.37 RA3.5 U2.101(PB0/TWI0-SCK) U3.2(SCK)
TWI0_SDA: P1.46 P4.35 RA3.8 U2.102(PB1/TWI0-SDA) U3.1(SDA)
TWI1_SCK: P1.43 RA3.7 U2.105(PB15/TWI1_SCK)
TWI1_SDA: P1.44 RA3.6 U2.106(PB16/TWI1_SDA)
TWI2_SCK: P1.25 R41.1 U2.161(PB17/TWI2_SCK)
TWI2_SDA: P1.26 R40.1 U2.160(PB18/TWI2_SDA)
UART1_RX: D10.3(C) P1.22 P3.1 U2.151(PG4/UART1_RX/EINT4)
UART1_TX: D11.3(C) P1.21 P3.2 U2.152(PG3/UART1_TX/EINT3)
UBOOT: R53.1 SW5.2(P2) U2.157(UBOOT)
USB0: F2.2 J1.3(D+) U2.94(UDP0)
USB0-DRV: R17.2 U2.10(PB10/SPI2_CS1/EINT24) U3.6(~{VBUSEN}) U4.4(EN)
USB0_N: F1.2 J1.2(D-) U2.93(UDM0)
USB1: F6.2 J2.3(D+) U2.96(UDP1)
USB1_N: F5.2 J2.2(D-) U2.95(UDM1)
VDD_RTC: C61.1 U3.28(LDO1)
VGH: C148.2 D7.A J5.41 R72.2 R73.1
VGL: C152.2 D9.A J5.42 R74.2 R78.1
VINT: C56.2 U3.26(VINT) U3.27(LDO1SET)
VSENSE: R29.1 R33.2 U5.5(VSENSE)
NetC2_1: C2.1 C3.2 R2.1 R3.1 U1.H1(VREFDQ) U1.M8(VREFCA)
NetC5_2: C5.2 R5.1
NetC6_1: C6.1 C9.1 L1.2 R4.1 U3.43(CHSENSE)
NetC11_2: C11.2 R6.1
NetC64_2: C64.2 U3.24(VREF)
NetC65_2: C65.2 U2.92(X24MIN) XT1.2(OUT)
NetC68_2: C68.2 U2.91(X24MOUT) XT1.1(IN)
NetC72_2: C72.2 FB1.1 R14.1 U4.1(OUT)
NetC73_1: C73.1 U3.11(LDO4)
NetC75_2: C75.2 R12.2 U3.47(PWRON)
NetC76_2: C76.2 C77.1 U2.80(VRP)
NetC78_2: C78.2 U2.83(VRA1)
NetC79_2: C79.2 C80.1 R21.2 U2.82(VRA2)
NetC89_2: C89.2 FB2.1 U6.1(OUT)
NetC90_1: C90.1 R26.1 R27.2
NetC91_1: C91.1 R27.1 U2.85(VMIC)
NetC93_2: C93.2 U2.84(MICIN1)
NetC96_2: C96.2 R28.1
NetC97_2: C97.2 C98.1 U2.75(HPBP)
NetC106_1: C106.1 C132.2 C133.1 D3.K Q1.S R66.2
NetC109_1: C109.1 R34.1
NetC110_1: C110.1 R35.1
NetC111_1: C111.1 R36.1
NetC135_1: C135.1 U11.8(SS)
NetC136_2: C136.2 R67.1
NetC142_1: C142.1 U12.8(SS)
NetC143_2: C143.2 R70.1
NetC145_1: C145.1 D6.3(C)
NetC147_2: C147.2 D6.2(K) R72.1
NetC149_2: C149.2 U13.5(COMP)
NetC150_1: C150.1 D8.3(C)
NetC151_2: C151.2 D8.1(A) R74.1
NetC155_1: C155.1 C156.2 FB5.2 J10.4(VCC)
NetD1_K: D1.K R16.1
NetD3_A: D3.A L7.2 U11.5(SW)
NetD5_A: D5.A L9.2 U13.3(SW)
NetD12_A: D12.A J8.4
NetFB2_2: FB2.2 J2.1(VBus)
NetL1_1: L1.1 U3.45(LX1)
NetL2_1: L2.1 U3.8(LX2)
NetL3_1: L3.1 U3.15(LX3)
NetL5_1: L5.1 U7.3(SW)
NetL6_1: L6.1 U10.3(SW)
NetLED1_K: LED1.K R8.1
NetQ2_G: Q2.G Q3.3(C) R79.1
NetR1_2: R1.2 U3.37(TS)
NetR8_2: R8.2 U3.36(CHGLED)
NetR10_2: R10.2 U1.L8(ZQ)
NetR11_2: R11.2 U3.23(BIAS)
NetR22_2: R22.2 U2.17(DZQ)
NetR24_1: R24.1 R29.2
NetR25_2: R25.2 U6.4(EN)
NetR32_2: R32.2 U5.8(RT)
NetR37_1: R37.1 R42.2 U7.5(FB)
NetR43_1: R43.1 R53.2 SW4.2(P2)
NetR52_1: R52.1 R58.2 U10.5(FB)
NetR66_1: R66.1 R68.2 U11.2(FB)
NetR67_2: R67.2 U11.1(COMP)
NetR69_1: R69.1 R71.2 U12.2(FB)
NetR70_2: R70.2 U12.1(COMP)
NetRA13_5: RA13.5 U2.145(PD5/LCD_D5)
NetRA13_6: RA13.6 U2.146(PD4/LCD_D4)
NetRA13_7: RA13.7 U2.147(PD3/LCD_D3)
NetRA13_8: RA13.8 U2.148(PD2/LCD_D2)
NetRA14_5: RA14.5 U2.136(PD15/LCD_D15)
NetRA14_6: RA14.6 U2.137(PD14/LCD_D14)
NetRA14_7: RA14.7 U2.138(PD13/LCD_D13)
NetRA14_8: RA14.8 U2.139(PD12/LCD_D12)
NetRA15_5: RA15.5 U2.132(PD21/LCD_D21)
NetRA15_6: RA15.6 U2.133(PD20/LCD_D20)
NetRA15_7: RA15.7 U2.134(PD19/LCD_D19)
NetRA15_8: RA15.8 U2.135(PD18/LCD_D18)
NetRA16_5: RA16.5 U2.140(PD11/LCD_D11)
NetRA16_6: RA16.6 U2.141(PD10/LCD_D10)
NetRA16_7: RA16.7 U2.130(PD23/LCD_D23)
NetRA16_8: RA16.8 U2.131(PD22/LCD_D22)
NetRA17_5: RA17.5 U2.128(PD25/LCD_DE)
NetRA17_6: RA17.6 U2.126(PD27/LCD_VSYNC)
NetRA17_7: RA17.7 U2.127(PD26/LCD_HSYNC)
NetRA17_8: RA17.8 U2.129(PD23/LCD_CLK)
NetRA18_5: RA18.5 U2.117(PE3/CSI_VSYNC/SPI2_MISO)
NetRA18_6: RA18.6 U2.116(PE2/CSI_HSYNC/SPI2_MOSI)
NetRA18_7: RA18.7 U2.115(PE1/CSI_MCLK/SPI2_CLK/EINT15)
NetRA18_8: RA18.8 U2.114(PE0/CSI_PCLK/SPI2_CS0/EINT14)
NetRA19_5: RA19.5 U2.121(PE7/CSI_D3/SDC2_D3)
NetRA19_6: RA19.6 U2.120(PE6/CSI_D2/SDC2_D2)
NetRA19_7: RA19.7 U2.119(PE5/CSI_D1/SDC2_D1)
NetRA19_8: RA19.8 U2.118(PE4/CSI_D0/SDC2_D0)
NetRA20_5: RA20.5 U2.125(PE11/CSI_D6/UART1_RX)
NetRA20_6: RA20.6 U2.124(PE10/CSI_D6/UART1_TX)
NetRA20_7: RA20.7 U2.123(PE9/CSI_D5/SDC2_CLK)
NetRA20_8: RA20.8 U2.122(PE8/CSI_D4/SDC2_CMD)
NetRA22_5: RA22.5 U2.111(PF3/SDC0_CMD/JTAG_TDO)
NetRA22_6: RA22.6 U2.110(PF2/SDC0_CLK/UART0_TX)
NetRA22_7: RA22.7 U2.108(PF1/SDC0_D0/JTAG_TDI)
NetRA22_8: RA22.8 U2.107(PF0/SDC0_D1/JTAG_TMS)
NetRA23_5: RA23.5 U2.113(PF5/SDC0_D2/JTAG_TCK)
NetRA23_6: RA23.6 U2.112(PF4/SDC0_D3/UART0_RX)
NetRA30_3: RA30.3 U2.143(PD7/LCD_D7)
NetRA30_4: RA30.4 U2.144(PD6/LCD_D6)

Not connected (* = marked no-connect by the designer): J3 2 4; J4 35; J5 1 4 45 49 50; J6 5 6; J7 4; P4 28 38; U1 J1(NC) J9(NC) L1(NC) L9(NC) M7(NC); U2 99(NC); U3 29(DC3SET) 30(BACKUP); U4 3(~{OC}); U5 7(EN); U6 3(~{OC}); U9 1(NC) 2(NC) 3(NC) 4(NC) 5(NC) 6(NC/R/B2#) 10(NC/CS2#) 11(NC) 14(NC) 15(NC) 20(NC/DNU) 21(NC/DNU) 22(NC/DNU) 23(NC) 24(NC) 25(NC) 26(NC) 27(NC) 28(NC) 33(NC) 34(NC) 35(NC) 38(NC/PRE) 39(NC) 40(NC) 45(NC) 46(NC) 47(NC) 48(NC)

## Layout directives
differential pair: DDCK, DDCK_N, DDQS0, DDQS0_N, DDQS1, DDQS1_N, DDR_CK, DDR_CK_N, DDR_DQS0, DDR_DQS0_N, DDR_DQS1, DDR_DQS1_N, USB0, USB0_N, USB1, USB1_N
net class DDR_DA_i: DBA0, DBA1, DBA2, DCAS, DCKE, DDA0, DDA1, DDA2, DDA3, DDA4, DDA5, DDA6, DDA7, DDA8, DDA9, DDA10, DDA11, DDA12, DDA13, DDA14, DDCK, DDCK_N, DDD0, DDD1, DDD2, DDD3, DDD4, DDD5, DDD6, DDD7, DDD8, DDD9, DDD10, DDD11, DDD12, DDD13, DDD14, DDD15, DDM0, DDM1, DDQS0, DDQS0_N, DDQS1, DDQS1_N, DDR_A0, DDR_A1, DDR_A2, DDR_A3, DDR_A4, DDR_A5, DDR_A6, DDR_A7, DDR_A8, DDR_A9, DDR_A10, DDR_A11, DDR_A12, DDR_A13, DDR_A14, DDR_BA0, DDR_BA1, DDR_BA2, DDR_CAS, DDR_CK, DDR_CK_N, DDR_CKE, DDR_D0, DDR_D1, DDR_D2, DDR_D3, DDR_D4, DDR_D5, DDR_D6, DDR_D7, DDR_D8, DDR_D9, DDR_D10, DDR_D11, DDR_D12, DDR_D13, DDR_D14, DDR_D15, DDR_DM0, DDR_DM1, DDR_DQS0, DDR_DQS0_N, DDR_DQS1, DDR_DQS1_N, DDR_RAS, DDR_RST, DDR_WE, DRAS, DRST, DWE

## Notes on the sheet
- Power
- CPU
- RAM
- All 33R
- USB
- (near U3) GTP
- (near C19) GTP
- GTP
- (near C102) GTP
- Seprate 3.3V reg required
- DRAM Power
- LCD
- 40 Pin LCD
- 50 Pin LCD
- (near F10) Audio Jack ESD Protection
- lots of exta circuit require to Drive 50pin 9'' LCD,
  with simple 40 LCD you may skip most of itText
- Expension Headers
- Li-Ion Boost converter
- (near L8) 50 Pin LCD, Boost converter
- (near P4) Expension LCD ,etc
- SD Card, Flash, JTAG,Debug UART
- LCD Backlight Driver
- ttyMay
- Gaurav Singh
- 1.0
- www.circuitvalley.com
- Title
- Size:
- Date:
- File:
- A1
- Number:
- Time:
- Revision:
- Sheet
- of

## Library data of the parts
C1-C5 C7-C19 C21-C23 C26-C37 C39 C41 C43-C46 C48 C55 C57-C63 C66 C71-C73 C76 C79 C81 C82 C86-C89 C94 C96 C97 C104 C105 C107 C114-C117 C130-C132 C136 C137 C139 C143-C148 C150-C156 C159 C160 = 0603C-10UF-6V3-X5R-MUR: CAPACITOR 0603 CERAMIC; Manufacturer: Murata Electronics North America; Manufacturer Part Number: GRM188R60J106ME47D; Reel: C24; Supplier 1: Digi-Key; Supplier Part Number 1: 490-3896-2-ND
C6 C56 C64 C67 C70 C75 C78 C84 C149 C157 = 0603C-1UF-25V-X5R-SAM: CAPACITOR 0603 CERAMIC; Reel: C17
C20 C38 = 0603C-1NF-50V-X7R-KEM: CAPACITOR 0603 CERAMIC; Reel: C45; Supplier 1: Digi-Key; Supplier Part Number 1: 399-1082-2-ND
C24 C25 C40 C42 C47 C49-C54 C74 C77 C80 C83 C90-C93 C95 C98 C109-C111 C118 C120 C126-C129 C135 C142 = 0603C-100NF-25V-X7R-TDK: CAPACITOR 0603 CERAMIC; Manufacturer Part Number: C1608X7R1E104K; Manufacturer: TDK Corporation; Reel: C12; Supplier 1: Digi-Key; Supplier Part Number 1: 445-1316-2-ND
C65 C68 = 0603C-33PF-50V-C0G-PAN: CAPACITOR 0603 CERAMIC; Reel: C42
C69 C102 C106 C112 C134 C138 C161 = CAPT_47u_1210_6V3: Capacitor SMD Tantalum 47uF 20% 6.3V 1210; Manufacturer 1: AVX Corporation; Manufacturer Part Number 1: TCJB476M006R0070; Manufacturer Size Code: B; Voltage - Rated: 6V3; ESR (Equivalent Series Resistance): 70.0 mOhm; Type: Molded; Package / Case: 1210 (3528 Metric); Tolerance: ±20%; Material: Tantalum; Supplier 1: Digi-Key; Supplier Part Number 1: 478-3139-1-ND; Operating Temperature: -55°C ~ 125°C; Size / Dimension: 0.138" L x 0.110" W (3.50mm x 2.80mm); Height - Seated (Max): 0.083" (2.10mm); ComponentLink1URL: http://www.avx.com/docs/Catalogs/tcj.pdf; ComponentLink1Description: http://www.avx.com/docs/Catalogs/tcj.pdf
  C69 C106 C161: Value: 10uf
  C102 C112 C134 C138: Value: 47µ
C85 = PANACAP-47UF-50V-FK: GENERIC CAPACITOR POLARISED; Supplier 1: Digi-Key; Supplier Part Number 1: PCE3816TR-ND
C99-C101 C103 C108 = 0603C-1NF-50V-X7R: CAPACITOR 0603 CERAMIC
C133 = CAPT_47u_6032_16V: Capacitor SMD Tantalum 47uF 10% 16V 6032-28; Manufacturer 1: Vishay/Sprague; Manufacturer Part Number 1: TR3C476K016C0300; Package / Case: EIA 535BAAC size C; Ratings: 16V; Tolerance: ±10%; Material: Tantalum; Supplier 1: Digi-Key; Supplier Part Number 1: 718-1332-1-ND; Value: 10uf
C158 = PANACAP-100UF-16V-FK: GENERIC CAPACITOR POLARISED; Supplier 1: Digi-Key; Supplier Part Number 1: PCE3783TR-ND
D1-D5 D7 D9 D12 = MBRS140: DIODE; Supplier 1: Digi-Key; Supplier Part Number 1: MBRS140FSTR-ND
D6 D8 D10 D11 = BAT54S: Schottky Barrier Double Diode; Published: 17-Sep-2003; LatestRevisionDate: 12-Dec-2006; LatestRevisionNote: IPC-7351 Footprint Added.; DatasheetVersion: 4-Mar-2002; PackageVersion: May-1999; PackageReference: SOT23; Publisher: Altium Limited; PackageDescription: 3-Pin SOT-23 Package 0.95 mm Pitch, 2.3 mm Lead Span; ComponentLink1Description: Manufacturer Link; ComponentLink1URL: http://www.semiconductors.philips.com/; ComponentLink2Description: Datasheet; ComponentLink2URL: http://www.semiconductors.philips.com/acrobat/datasheets/BAT54_SERIES_4.pdf
F1-F24 = ESD_SUPPRESSOR_24VDC: ESD Suppressor 24VDC 0603 SMD; Manufacturer 1: Cooper Bussmann; Manufacturer Part Number 1: 0603ESDA-TR1; Voltage - Working: 24V; Voltage - Clamping: 35V; Package / Case: 0603 (1608 metric); Supplier 1: Digi-Key; Supplier Part Number 1: 283-2535-1-ND; ComponentLink1URL: http://www.cooperindustries.com/content/dam/public/bussmann/Electronics/Resources/Data%20Sheets/Bus_Elx_DS_4082_0603ESDA-TR.pdf; ComponentLink1Description: http://www.cooperindustries.com/content/dam/public/bussmann/Electronics/Resources/Data%20Sheets/Bus_Elx_DS_4082_0603ESDA-TR.pdf
FB1 FB2 FB4 FB5 = 0805FB-GENERIC: FERRITE BEAD SMD
J3 J7 = Audio SMD 3.5mm
J5 = CL586-0559-3: FH12 Series, "Flip-Lock" SMT/ZIF FFC/FPC Connector - 0.5mm Spaced Top Contact; Positions: 50; ContactMaterial: Phosphor Bronze; Current: 0.4A; PCB_Layout: Complies with manufacturer's recommendation.; Note: Pad dimensions follow nominal values, Suitable for Wave Soldering, Adjust for Re-flow.; Published: 17-Jul-2002; DatasheetVersion: 13-Nov-2000; PackageVersion: 13-Nov-2000; PackageReference: FH12A-50S-0.5SH; Publisher: Altium Limited; ComponentLink1Description: Manufacturer Link; ComponentLink1URL: http://www.hiroseusa.com/; ComponentLink2Description: Datasheet; ComponentLink2URL: http://www.hirose.co.jp/cataloge_hp/e58605370.pdf
J6 = 52793-0470
L1-L3 L5-L8 = inductor_smd
L4 L9 = Inductor Iron: Magnetic-Core Inductor; Published: 24-Mar-1999; LatestRevisionDate: 17-Jul-2002; LatestRevisionNote: Re-released for DXP Platform.; PackageReference: AXIAL-0.9; Publisher: Altium Limited; PackageDescription: Axial Device, Thru-Hole; 2 Leads; 0.9 in Pin Spacing
LED1 = LED_SMD_Blue_0805_100mcd: LED 0805 SMD Blue 100mcd 470nm; Manufacturer 1: Ligitek; Manufacturer Part Number 1: LG-170DBKZ-CT; Material: InGaN/GaN; Ratings: 100 mcd; 470 nm; Package / Case: 0805; Value: Blue; Color: Blue
P1 = Header 25X2: Header, 25-Pin, Dual row; LatestRevisionDate: 17-Jul-2002; LatestRevisionNote: Re-released for DXP Platform.; Publisher: Altium Limited
P2 = Header 7: Header, 7-Pin; LatestRevisionDate: 17-Jul-2002; LatestRevisionNote: Re-released for DXP Platform.; Publisher: Altium Limited
P3 = Header 3: Header, 3-Pin; LatestRevisionDate: 17-Jul-2002; LatestRevisionNote: Re-released for DXP Platform.; Publisher: Altium Limited
P4 = Header 19X2: Header, 19-Pin, Dual row; LatestRevisionDate: 17-Jul-2002; LatestRevisionNote: Re-released for DXP Platform.; Publisher: Altium Limited
P5 P6 = Header 2: Header, 2-Pin; LatestRevisionDate: 17-Jul-2002; LatestRevisionNote: Re-released for DXP Platform.; Publisher: Altium Limited
Q1 Q2 = DMP2305: P CHANNEL MOSFET; Manufacturer Part Number: DMP2305U-7; Manufacturer: Diodes Inc; Input Capacitance (Ciss) @ Vds: 727pF @ 20V; Gate Charge (Qg) @ Vgs: 7.6nC @ 4.5V; FET Type: MOSFET P-Channel, Metal Oxide; Rds On (Max) @ Id, Vgs: 60 mOhm @ 4.2A, 4.5V; Drain to Source Voltage (Vdss): 20V; Vgs(th) (Max) @ Id: 900mV @ 250µA; Power - Max: 1.4W; Current - Continuous Drain (Id) @ 25° C: 4.2A; FET Feature: Logic Level Gate; Supplier 1: Digi-Key; Packaging: Tape & Reel (TR); RoHS: RoHS Compliant; Supplier: Digi-Key; Mounting Type: Surface Mount; Category: Discrete Semiconductor Products; Package / Case: SOT-23; Supplier Part Number 1: DMP2305UDITR-ND; Supplier Part Number: DMP2305UDITR-ND
Q3 = BC847: NPN General-purpose Transistor; Published: 17-Sep-2003; LatestRevisionDate: 12-Dec-2006; LatestRevisionNote: IPC-7351 Footprint Added.; DatasheetVersion: 4-Feb-2002; PackageVersion: May-1999; PackageReference: SOT23; Publisher: Altium Limited; PackageDescription: 3-Pin SOT-23 Package 0.95 mm Pitch, 2.3 mm Lead Span; ComponentLink1Description: Manufacturer Link; ComponentLink1URL: http://www.semiconductors.philips.com/; ComponentLink2Description: Datasheet; ComponentLink2URL: http://www.semiconductors.philips.com/acrobat/datasheets/BC846_BC847_BC848_5.pdf
R1 = 0603R-240: GENERIC RESISTOR 0603; Manufacturer Part Number: RMCF 1/16 15K 1% R; Manufacturer: Stackpole Electronics Inc; Tolerance: ±1%; Resistance In Ohms: 15.0K; Power (Watts): 0.1W, 1/10W; Temperature Coefficient: ±100ppm/°C; Supplier 1: Digi-Key; Supplier Part Number 1: RMCF1/1615KFRTR-ND; Supplier: Digi-Key; Supplier Part Number: RMCF1/1615KFRTR-ND; Packaging: Tape & Reel (TR); Category: Resistors; Case: 0603 (1608 metric); Composition: Thick Film; Lead Style: Surface Mount (SMD - SMT); RoHS: RoHS Compliant
R2 R3 R7 R9 R14 R17 R19 R23 R25 R46-R49 R59 = 0603R-10K: GENERIC RESISTOR 0603; Manufacturer: Stackpole Electronics Inc; Manufacturer Part Number: RMCF 1/16 10K 1% R; Tolerance: ±1%; Power (Watts): 0.1W, 1/10W; Temperature Coefficient: ±100ppm/°C; Resistance In Ohms: 10.0K; Reel: R21; Category: Resistors; Supplier Part Number: RMCF1/1610KFRDKR-ND; Lead Style: Surface Mount (SMD - SMT); RoHS: RoHS Compliant; Packaging: Digi-Reel®; Case: 0603 (1608 metric); Composition: Thick Film; Supplier: Digi-Key; Supplier 1: Digi-Key; Supplier Part Number 1: RMCF0603FT10K0DKR-ND
R4 = 2512R-7R5: GENERIC RESISTOR 2512; Manufacturer Part Number: CRCW25127R50JNEG; Manufacturer: Vishay/Dale; REEL: R20; Supplier 1: Digi-Key; Supplier Part Number 1: 541-7.5XDKR-ND
R5 R6 = 0603R-1R: GENERIC RESISTOR 0603; Manufacturer Part Number: CSR 1/8 1 1% I; Manufacturer: Stackpole Electronics Inc; Temperature Coefficient: ±300ppm/°C; Resistance In Ohms: 1.00; Power (Watts): 0.125W, 1/8W; Tolerance: ±1%; REEL: R50; Lead Style: Surface Mount (SMD - SMT); Supplier: Digi-Key; Supplier Part Number: CSR1/81FITR-ND; Composition: Current Sense, Thick Film; Category: Resistors; Packaging: Tape & Reel (TR); RoHS: RoHS Compliant; Case: 0603 (1608 metric); Supplier 1: Digi-Key; Supplier Part Number 1: CSR0603FK1R00DKR-ND
R8 R11 R21 R26 R27 R34-R36 R39-R41 R43 R50 R51 R53 R61 = 0603R-220K: GENERIC RESISTOR 0603; Manufacturer: Stackpole Electronics Inc; Manufacturer Part Number: RMCF 1/16 220K 1% R; Resistance In Ohms: 220K; Power (Watts): 0.1W, 1/10W; Temperature Coefficient: ±100ppm/°C; Tolerance: ±1%; Supplier 1: Digi-Key; Supplier Part Number 1: RMCF1/16220KFR-ND; RoHS: RoHS Compliant; Composition: Thick Film; Lead Style: Surface Mount (SMD - SMT); Supplier: Digi-Key; Supplier Part Number: RMCF1/16220KFR-ND; Packaging: Tape & Reel (TR); Category: Resistors; Case: 0603 (1608 metric)
R10 R22 = 0603R-10K: GENERIC RESISTOR 0603; Manufacturer: Stackpole Electronics Inc; Manufacturer Part Number: RMCF 1/16 10K 1% R; Power (Watts): 0.1W, 1/10W; Temperature Coefficient: ±100ppm/°C; Resistance In Ohms: 10.0K; Reel: R21; Category: Resistors; Supplier Part Number: RMCF1/1610KFRDKR-ND; Lead Style: Surface Mount (SMD - SMT); Tolerance: ±1%; RoHS: RoHS Compliant; Packaging: Digi-Reel®; Case: 0603 (1608 metric); Composition: Thick Film; Supplier: Digi-Key; Supplier 1: Digi-Key; Supplier Part Number 1: RMCF0603FT10K0DKR-ND
R12 R15 R24 R28-R30 R32 R33 R37 R42 R44 R45 R52 R54-R58 R60 R64-R79 = 0603R-2K2: GENERIC RESISTOR 0603; Manufacturer Part Number: RMC 1/16 2.2K 1% R; Manufacturer: Stackpole Electronics Inc; REEL: R88; Supplier 1: Digi-Key; Supplier Part Number 1: RMCF0603FT2K20TR-ND
R13 R16 = 0603R-47K: GENERIC RESISTOR 0603; Manufacturer: Stackpole Electronics Inc; Manufacturer Part Number: RMC 1/16 47K 1% R; Tolerance: ±1%; Resistance In Ohms: 47.0K; Temperature Coefficient: ±100ppm/°C; Power (Watts): 0.1W, 1/10W; REEL: R66; Supplier 1: Digi-Key; Supplier Part Number 1: RMC1/1647KFR-ND; RoHS: RoHS Compliant; Supplier: Digi-Key; Packaging: Tape & Reel (TR); Composition: Thick Film; Case: 0603 (1608 metric); Supplier Part Number: RMC1/1647KFR-ND; Lead Style: Surface Mount (SMD - SMT); Category: Resistors
R18 R20 R81-R86 = 0402R-GENERIC: RESISTOR 0402 GENERIC
RA1-RA10 RA12-RA20 RA22-RA30 = RES_ARRAY_0402_5%: Resistor array 4-pack 5% 0402 SMD
U1 = K4B4G1646D-BCK0: 1Gb DDR3-1333 SDRAM, 256Mb x 16, 1.5ns, 1.5V, -40 to 95 degC, 96-Ball FBGA, Pb-Free; Manufacturer: Micron; CL: CL = 9; Clock Rate: 667 MHz; Op. Temp.: -40C to +95C; DatasheetVersion: Rev. K; PackageVersion: Rev.G; PackageReference: MICT-JT-96; PackageDescription: 96-Ball Fine-Pitch Ball Grid Array, 14 x 8 mm, Pitch 0.8 mm; Cycle Time: 1.5ns; Data Rate: DDR3-1333; Density: 1Gb; Depth: 64Mb; Package: FBGA; Pin Count: 96-ball; RoHS: Yes; Voltage: 1.5V; Width: x16; Mounting Technology: Surface Mount; PartNumber: K4B4G1646D-BCK0; ComponentLink2Description: Datasheet; ComponentLink3Description: Package Specification
U11 U12 = TPS61085DGKR: 18.5 V, 2 A, 650 KHz / 1.2 MHz Step-Up DC-DC Converter with Forced PWM Mode, 2.3 to 6 V, -40 to 85 degC, 8-pin SOP (DGK8), Green (RoHS & no Sb/Br); Manufacturer: Texas Instruments; Iout(Max)(A): 2; Iq(Typ)(mA): 0.07; Rating: Catalog; SubFamily: White LED Driver; Switching Frequency(Typ)(kHz): 650, 1200; Topology: Boost; Vin(Max)(V): 6; Vin(Min)(V): 2.3; DatasheetVersion: SLVS859; PackageVersion: 4073329/E; PackageReference: DGK8; PackageDescription: 8-Pin Thin Small Outline Package 3 x 3 mm Body ,0.65 mm Pitch; Supplier 1: Digi-Key; Supplier Part Number 1: TPS61085DGKR-ND; Supplier 2: Mouser; Supplier Part Number 2: 595-TPS61085DGKR; Eco-Plan: Green (RoHS & no Sb/Br); Mounting Technology: Surface Mount; Code_JEDEC: MO-187; PartNumber: TPS61085DGKR; ComponentLink1Description: Manufacturer URL; ComponentLink1URL: http://www.ti.com/; ComponentLink2Description: Datasheet; ComponentLink2URL: http://www.ti.com/general/docs/lit/getliterature.tsp?genericPartNumber=TPS61085&fileType=pdf; ComponentLink3Description: Package Specification; ComponentLink3URL: http://www.ti.com/litv/pdf/mpds028d
U13 = TPS61165DBVR: High Brightness White LED Driver, 3 to 18 V, -40 to 85 degC, 6-pin SOT23 (DBV6), Green (RoHS & no Sb/Br); Manufacturer: Texas Instruments; Dimming: TRUE; Iq(Typ)(mA): 1.5; Rating: Catalog; Switching Frequency(Max)(kHz): 1200; Topology: Boost; Vin(Max)(V): 18; Vin(Min)(V): 3; DatasheetVersion: SLVS790B; PackageVersion: 4073253-5/K; PackageReference: DBV6; PackageDescription: 6-Pin Plastic Small Outline, Body 1.60 Ã— 2.90 mm, Pitch 0.95 mm; Supplier 1: Digi-Key; Supplier Part Number 1: 296-27597-2-ND; Supplier 2: Digi-Key; Supplier Part Number 2: 296-27597-1-ND; Supplier 3: Digi-Key; Supplier Part Number 3: 296-27597-6-ND; Supplier 4: Newark; Supplier Part Number 4: 79R8563; Supplier 5: Mouser; Supplier Part Number 5: 595-TPS61165DBVR; Eco-Plan: Green (RoHS & no Sb/Br); SubFamily: White LED Driver; Synchronous Rectification: TRUE; Mounting Technology: Surface Mount; Code_JEDEC: MO-178; PartNumber: TPS61165DBVR; ComponentLink1Description: Manufacturer URL; ComponentLink1URL: http://www.ti.com/; ComponentLink2Description: Datasheet; ComponentLink2URL: http://www.ti.com/general/docs/lit/getliterature.tsp?genericPartNumber=TPS61165&fileType=pdf; ComponentLink3Description: Package Specification; ComponentLink3URL: http://www.ti.com/litv/pdf/mpds026h
XT1 = crystal_cermaic